# EasyEDA Pro project ProPrj_Smart_Screen_T113_PCB6.epro, schematic Schematic

## Sheets
1 CORE: Board Name: Board1_MIPI; Create Date: 2025-05-10; Page Name: CORE; Project Name: Smart_Screen_T113_1; Schematic Name: Schematic1_5; Update Date: 2025-05-10; Company: 嘉立创EDA; Page Size: A3; Version: V1.0
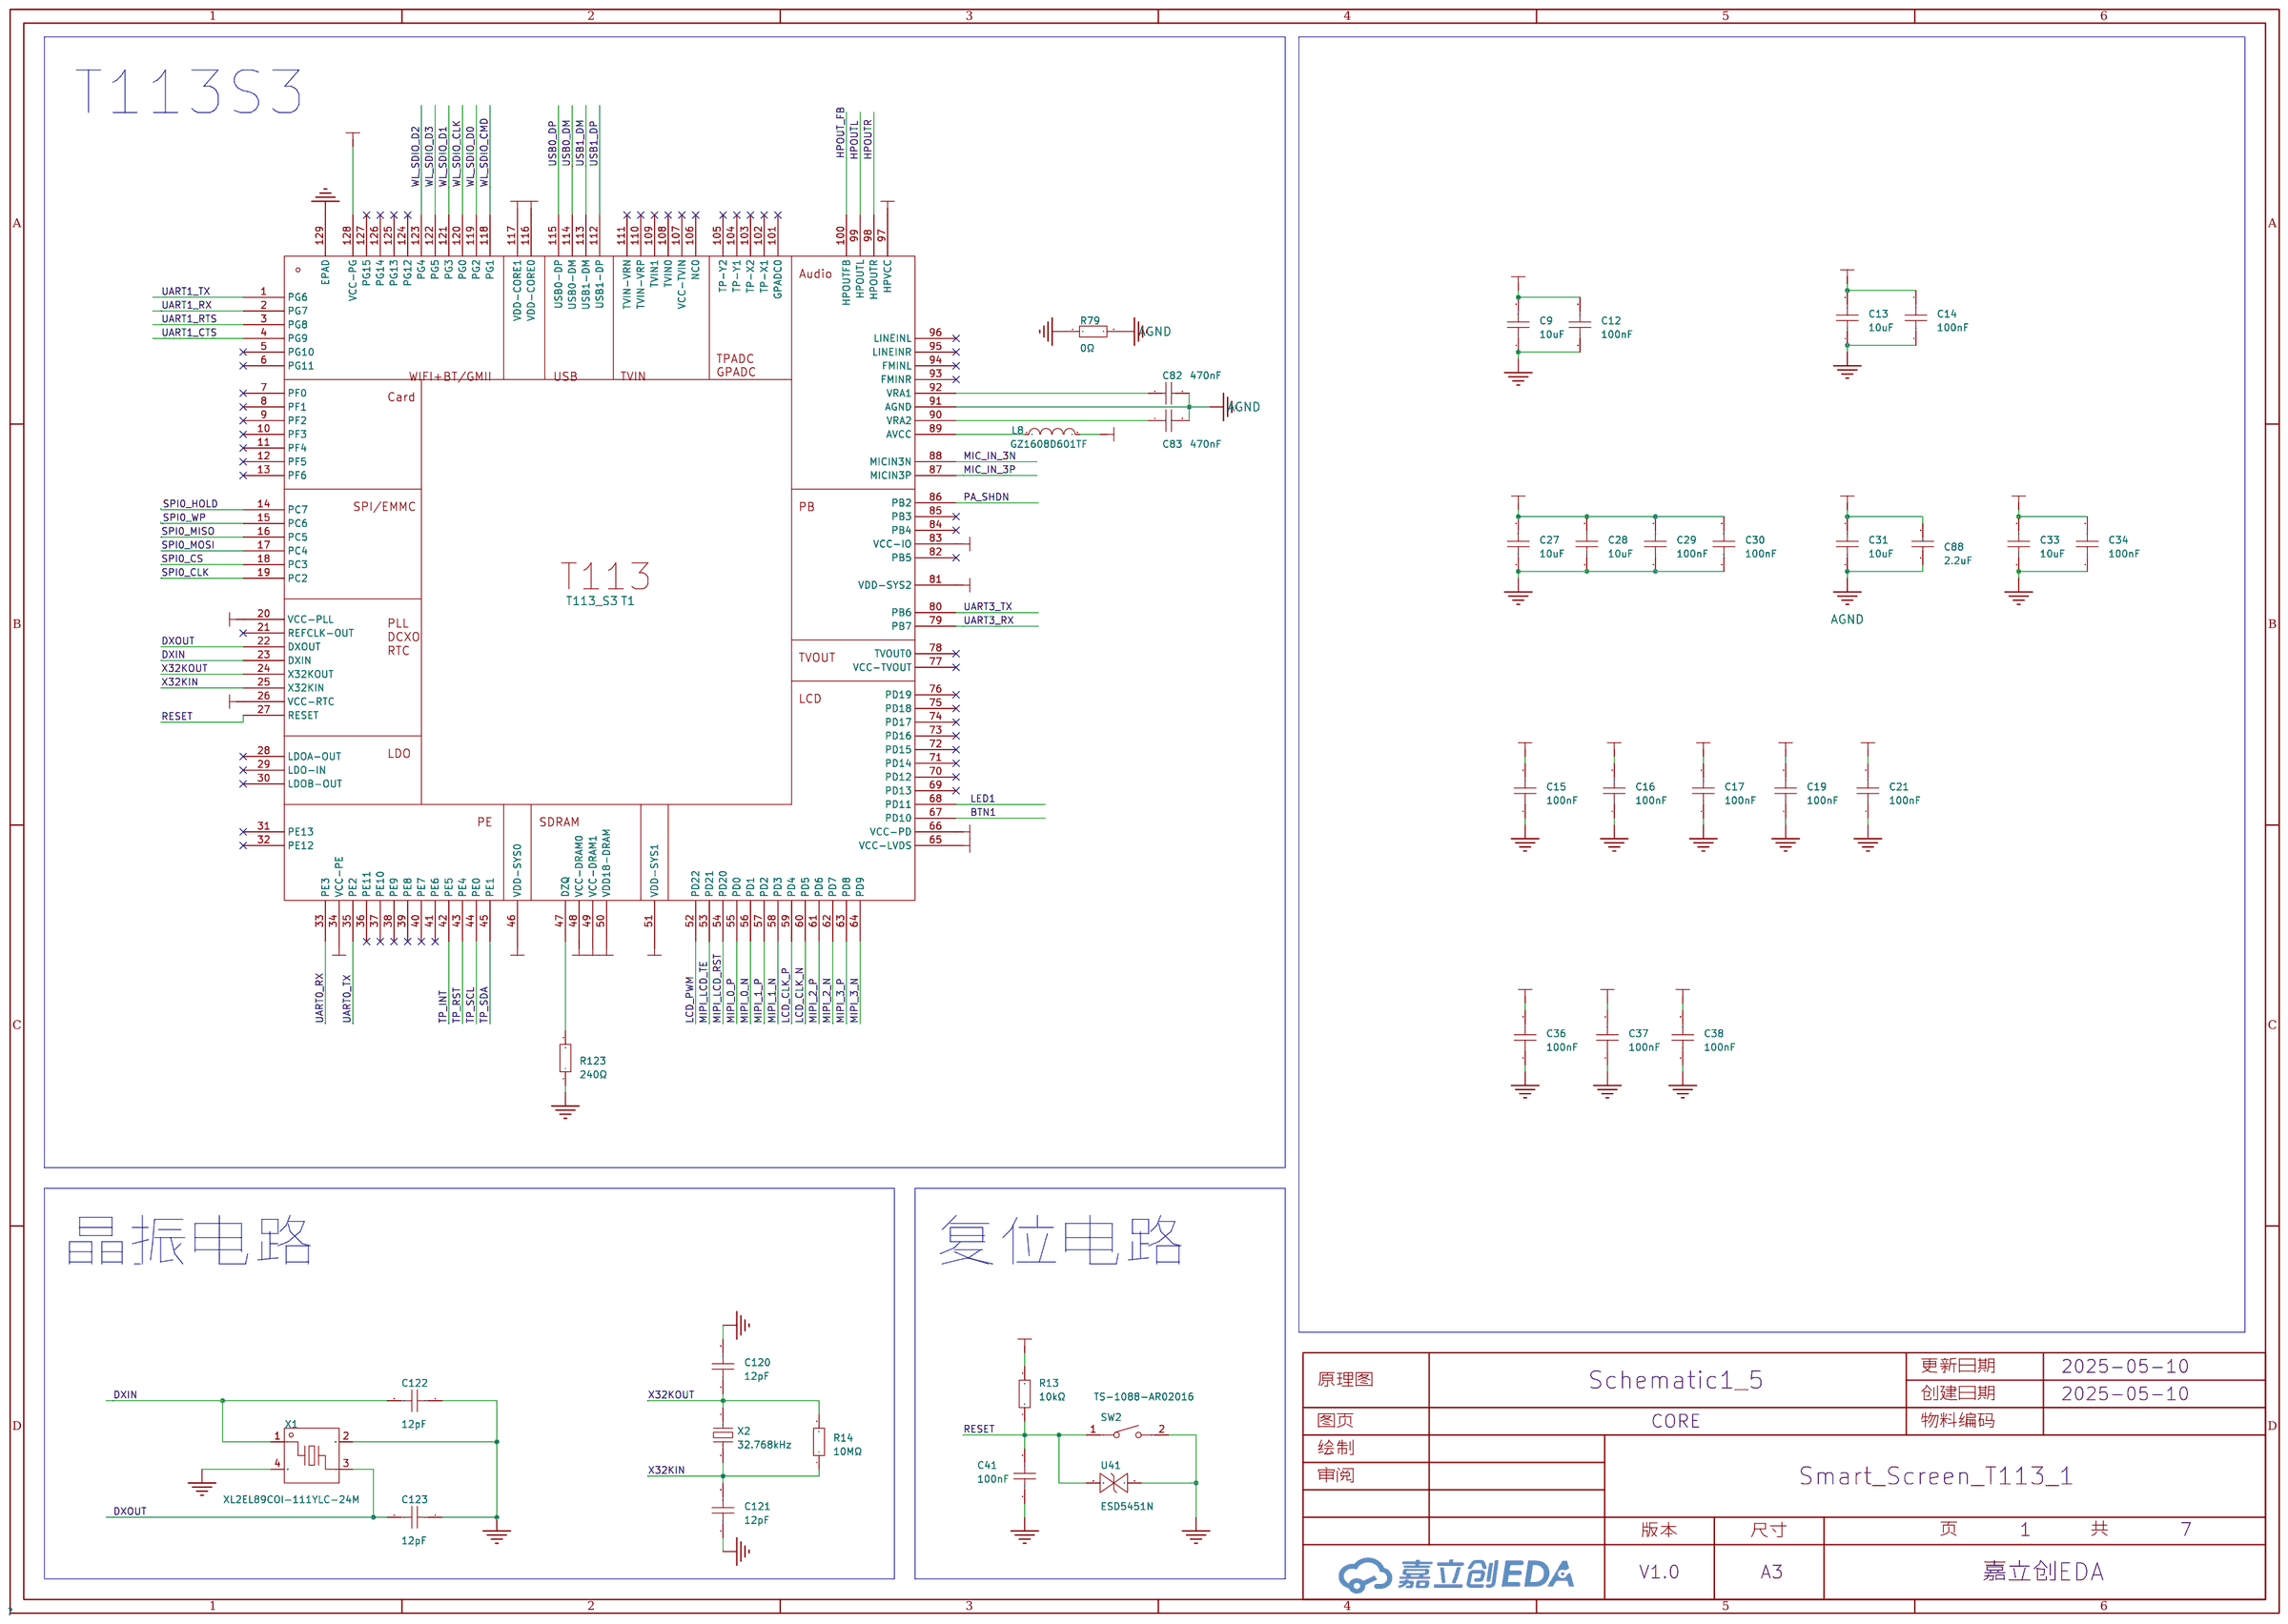
[diagram p0: CORE]
2 NET: Board Name: Board_MIPI_6_90in; Create Date: 2025-06-16; Page Name: NET; Project Name: Smart_Screen_T113_2; Schematic Name: Schematic; Update Date: 2025-06-16
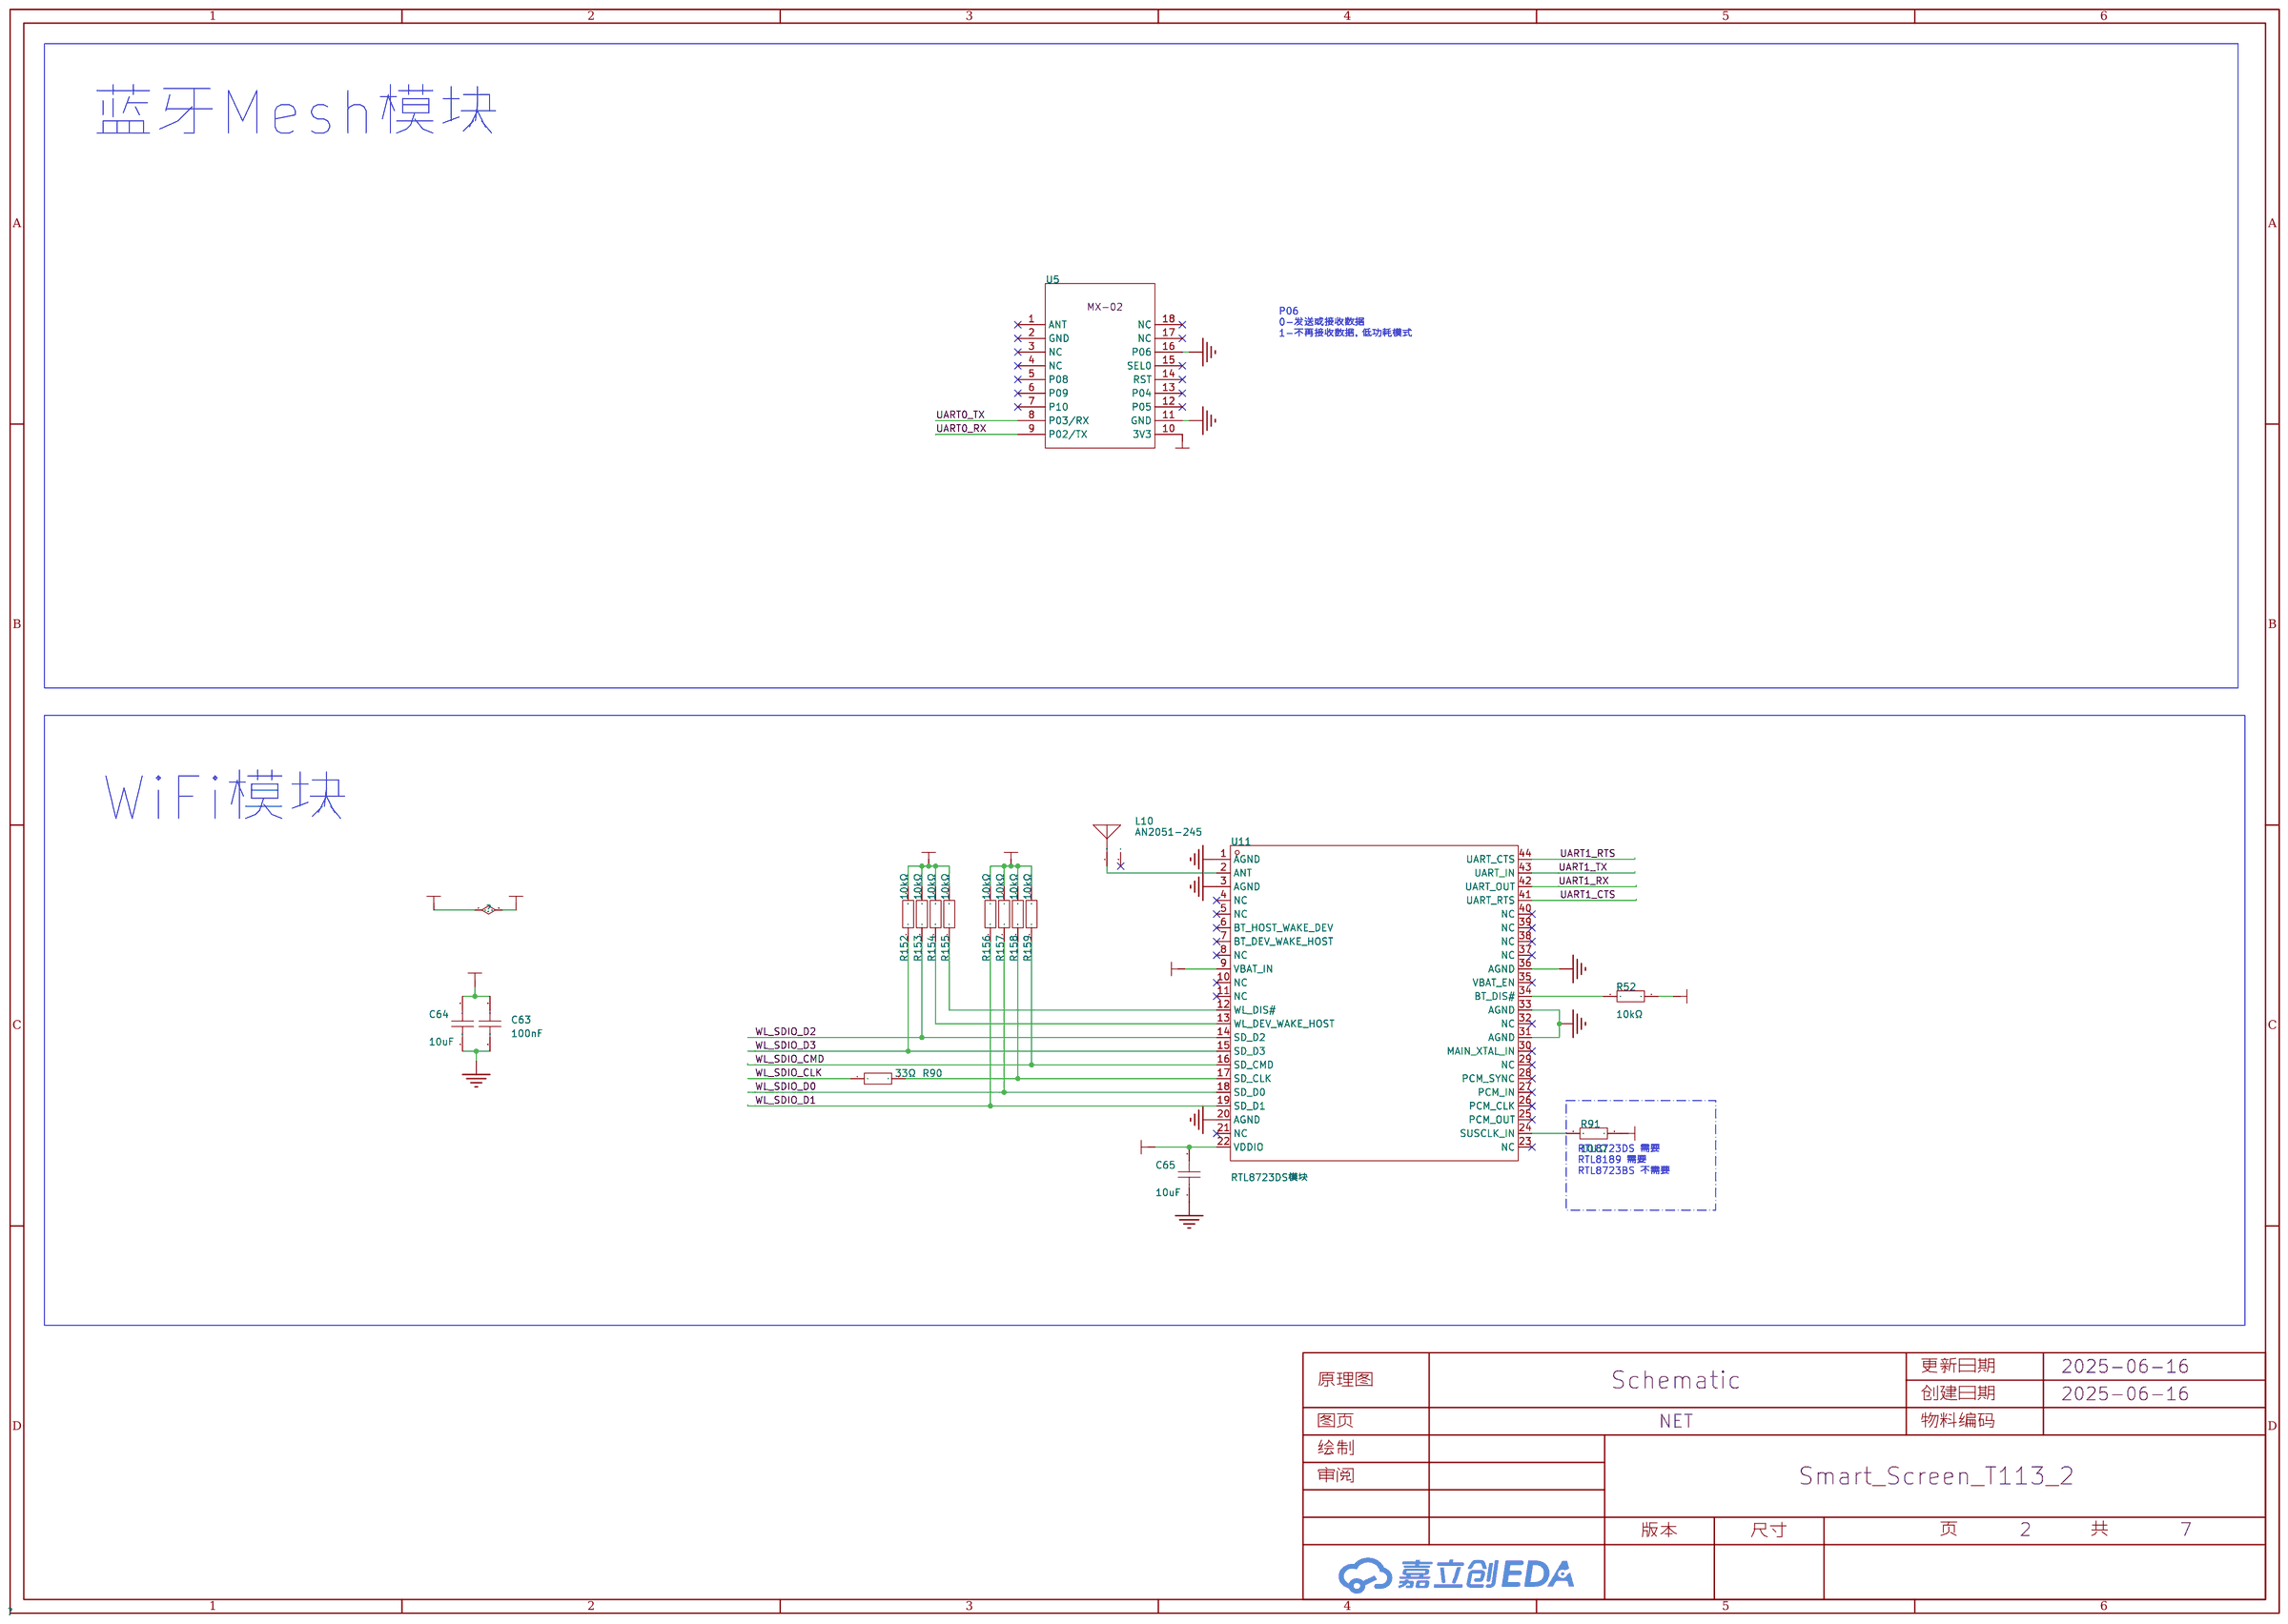
[diagram p1: NET]
3 POWER: Board Name: Board_MIPI_6_90in; Create Date: 2025-06-16; Page Name: POWER; Project Name: Smart_Screen_T113_2; Schematic Name: Schematic; Update Date: 2025-06-16
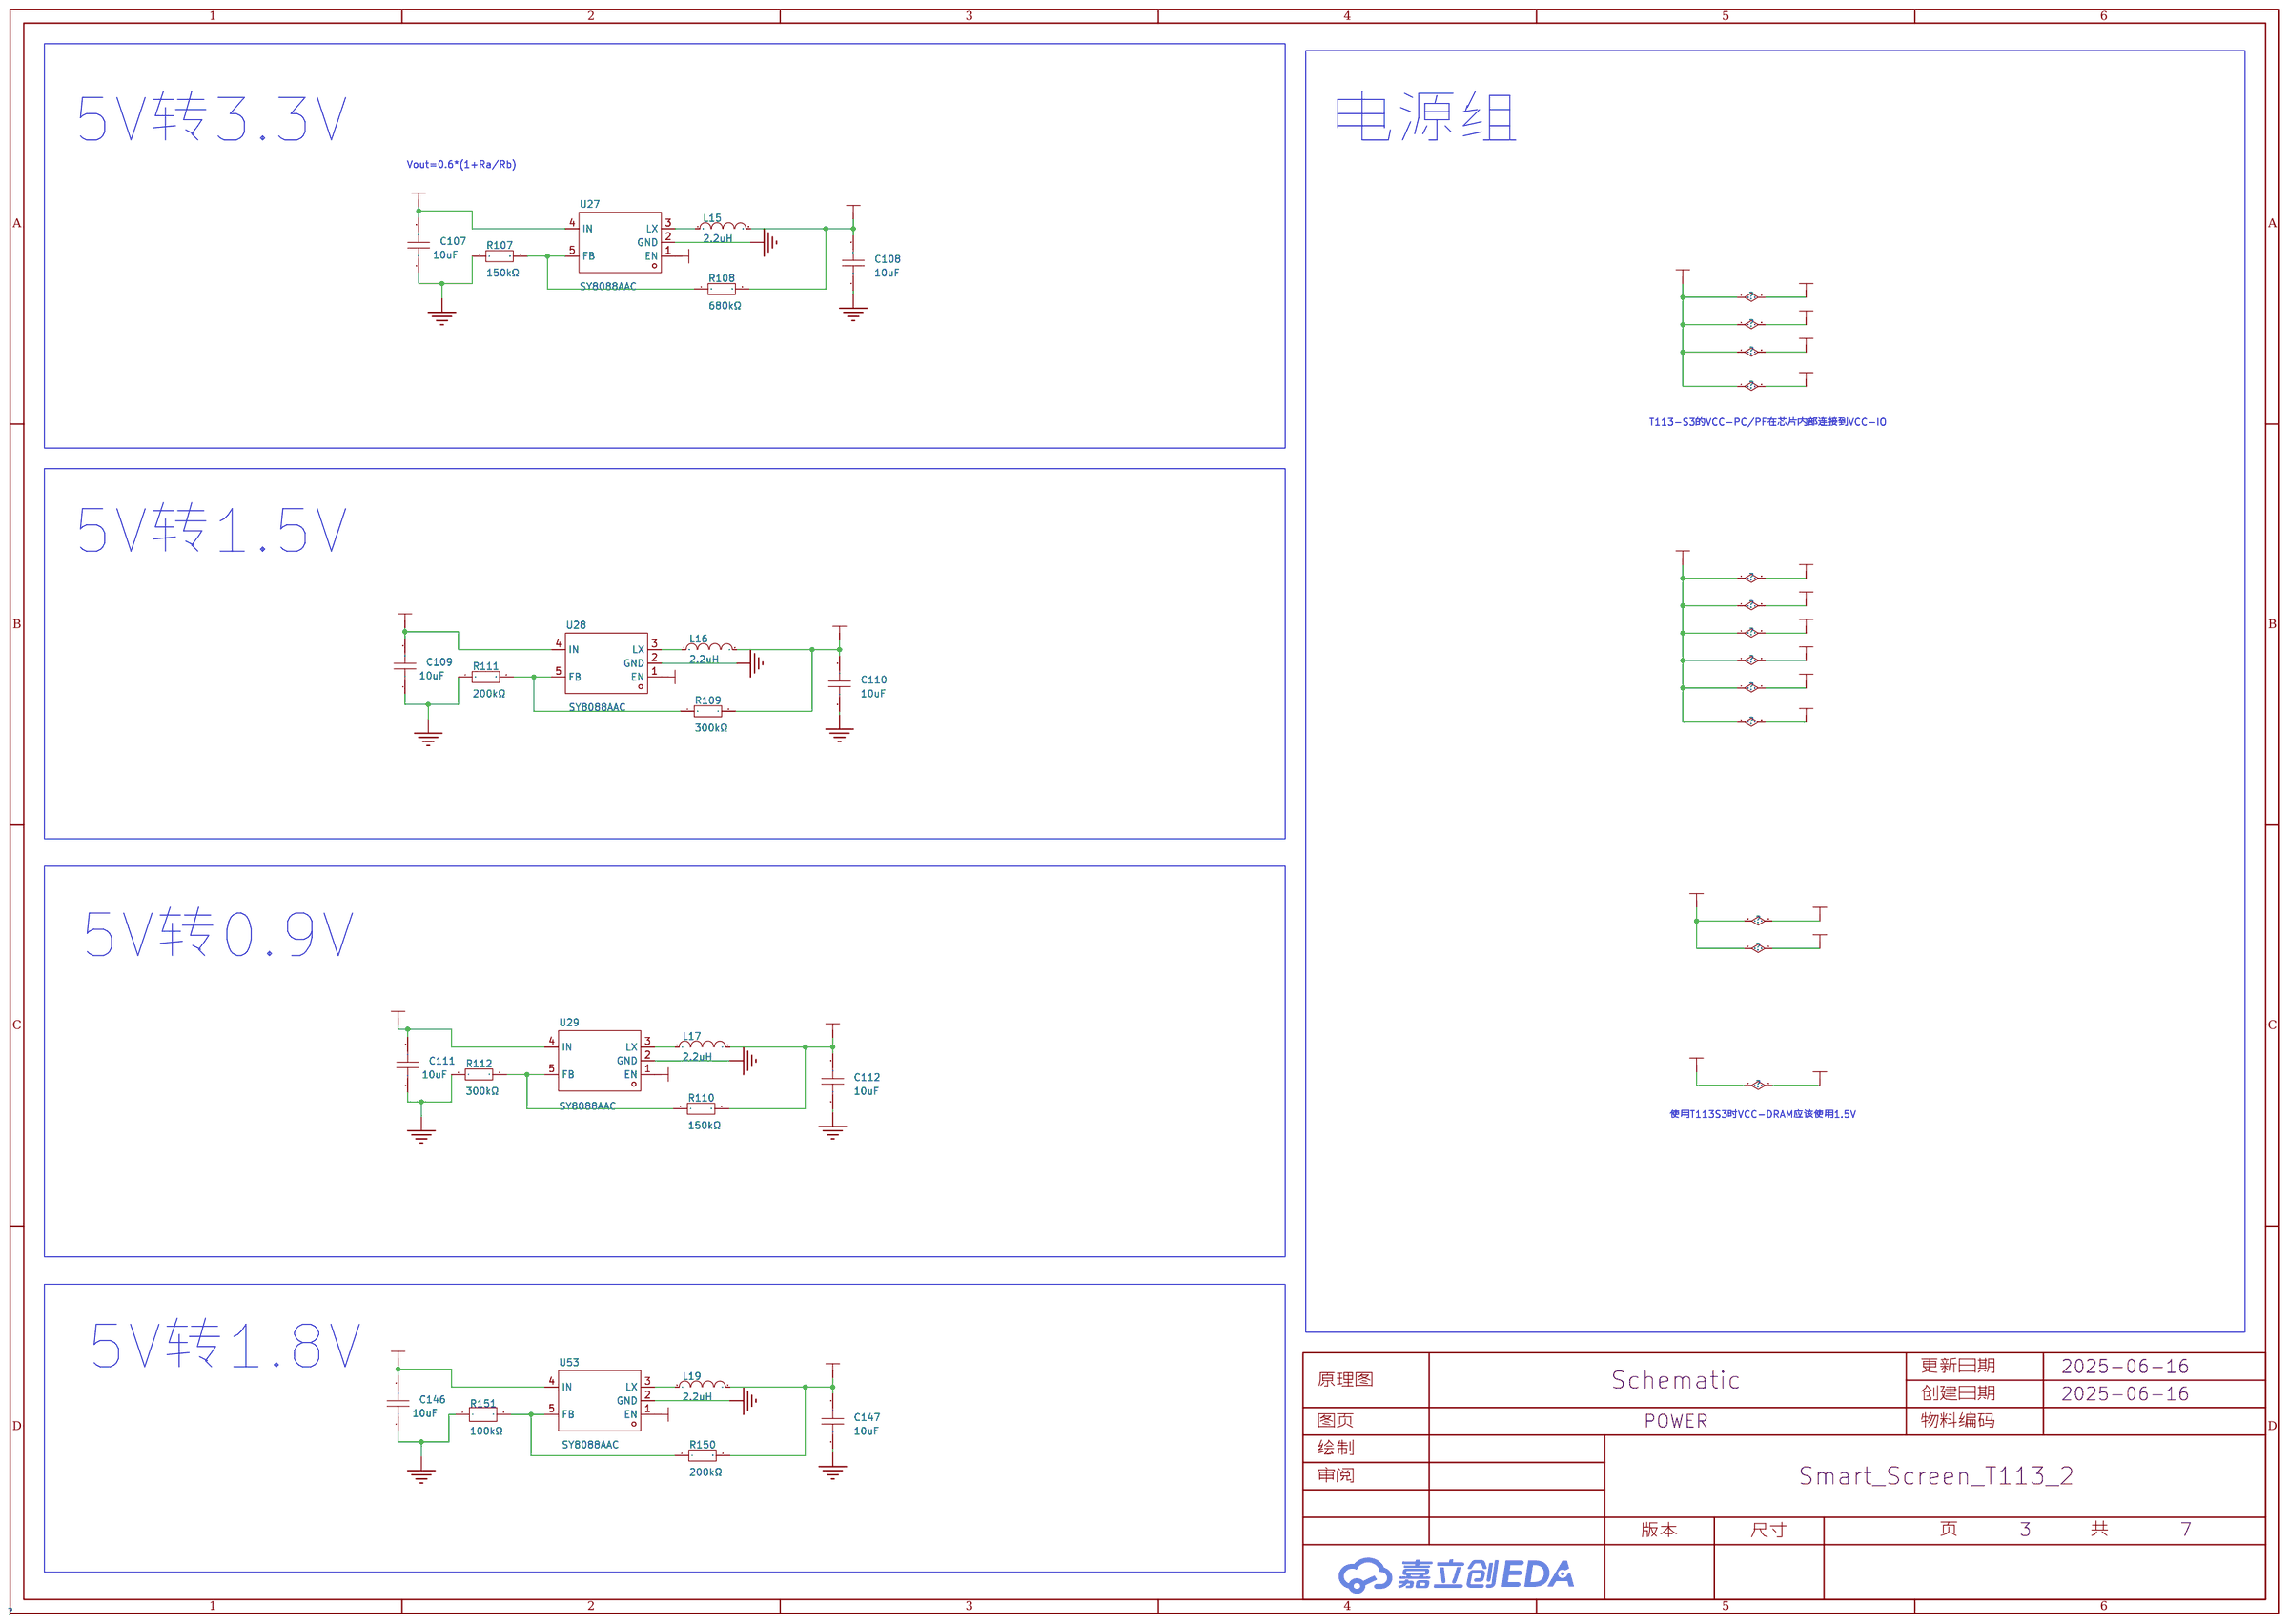
[diagram p2: POWER]
4 CONNECT: Page Name: CONNECT
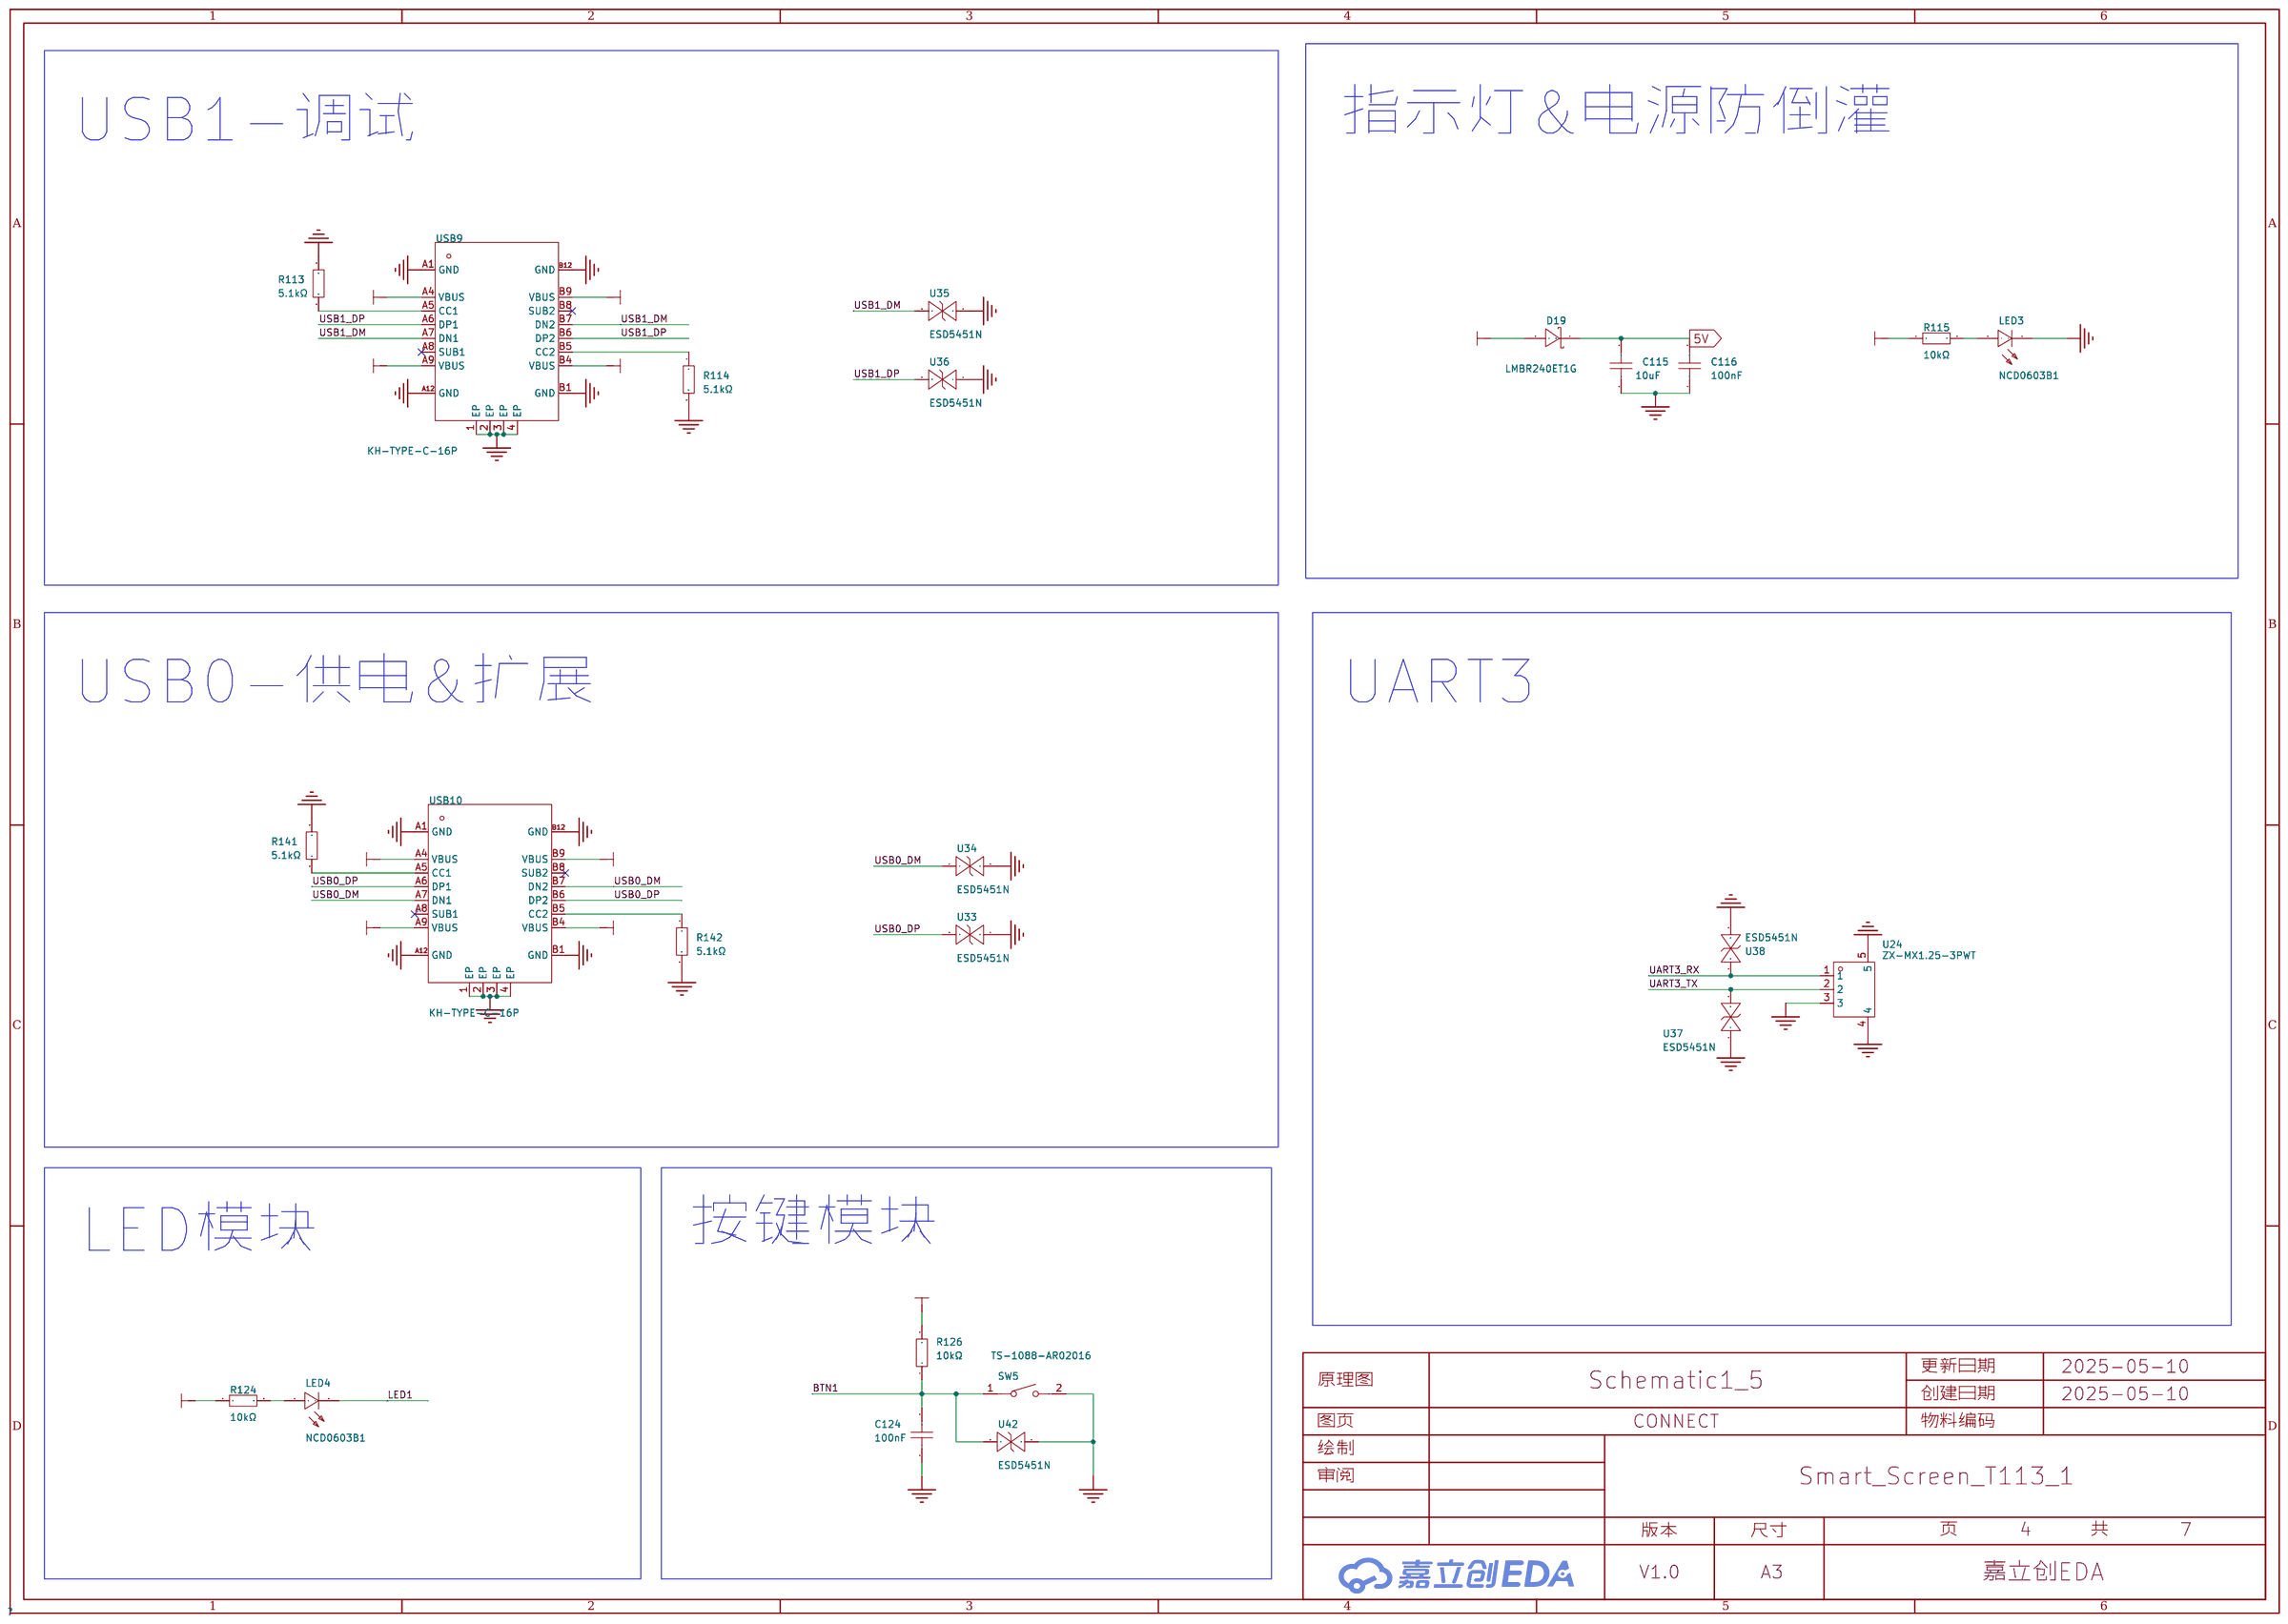
[diagram p3: CONNECT]
5 AUDIO: Page Name: AUDIO
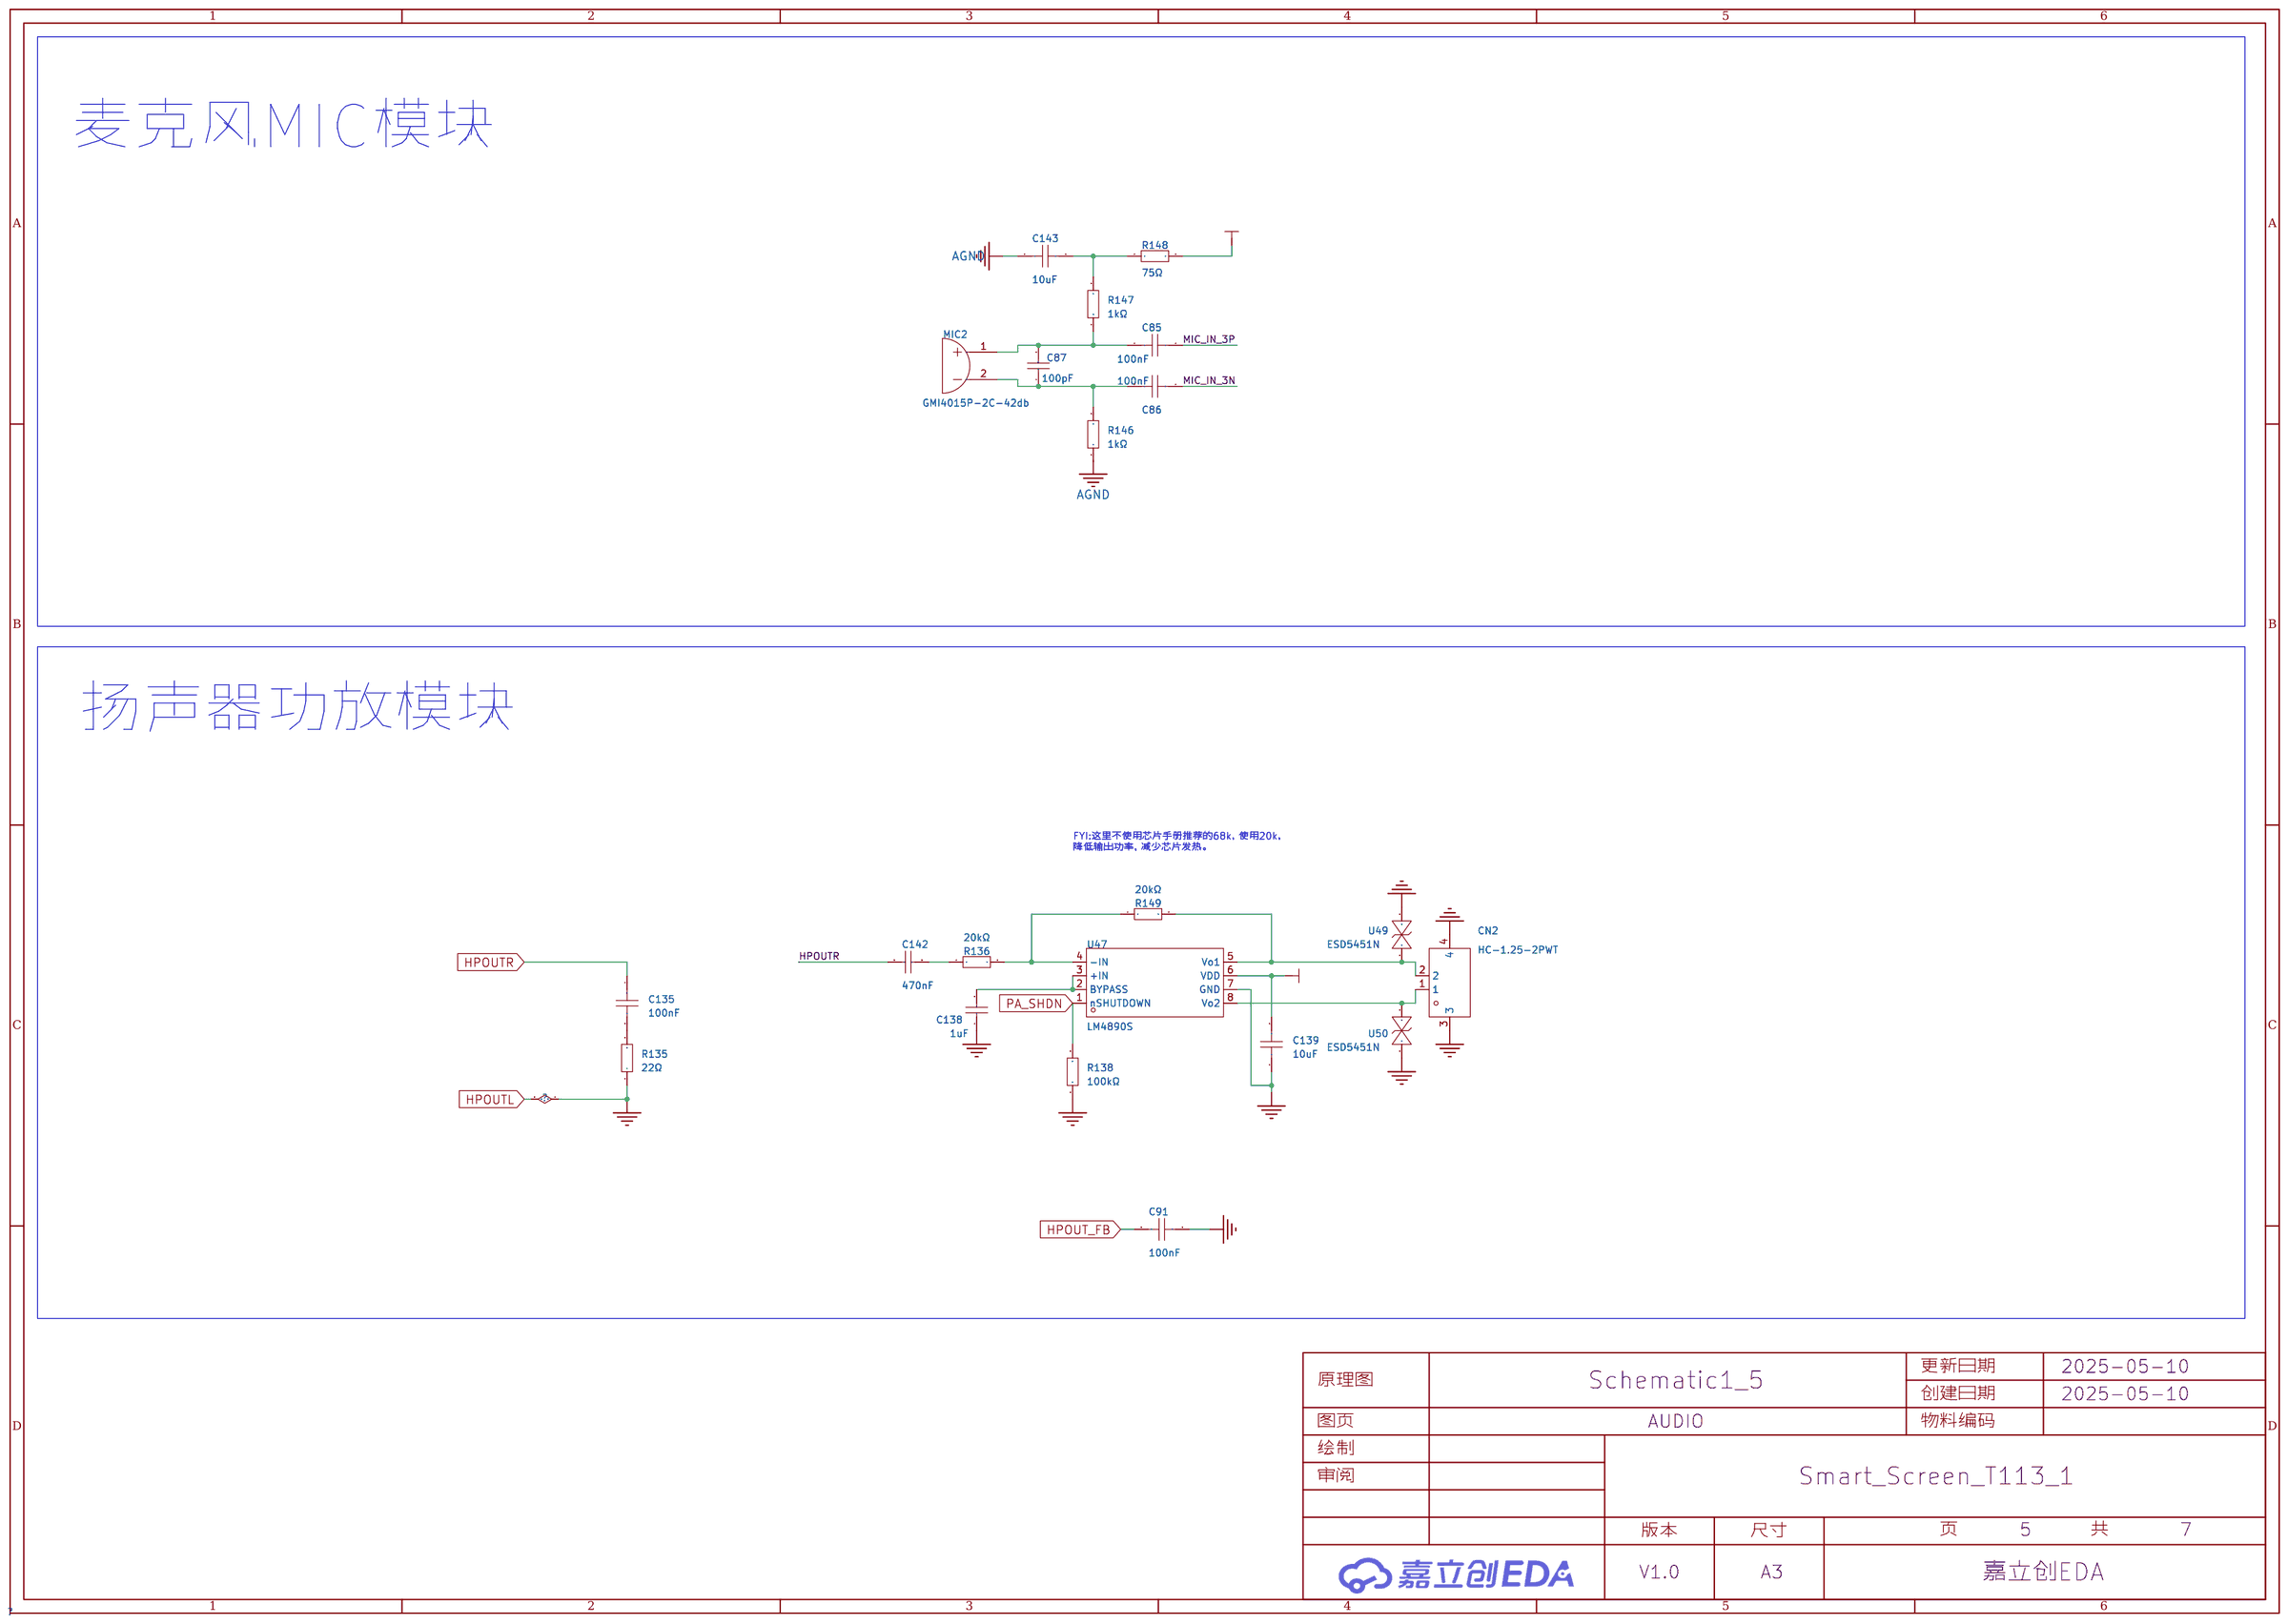
[diagram p4: AUDIO]
6 FLASH: Page Name: FLASH
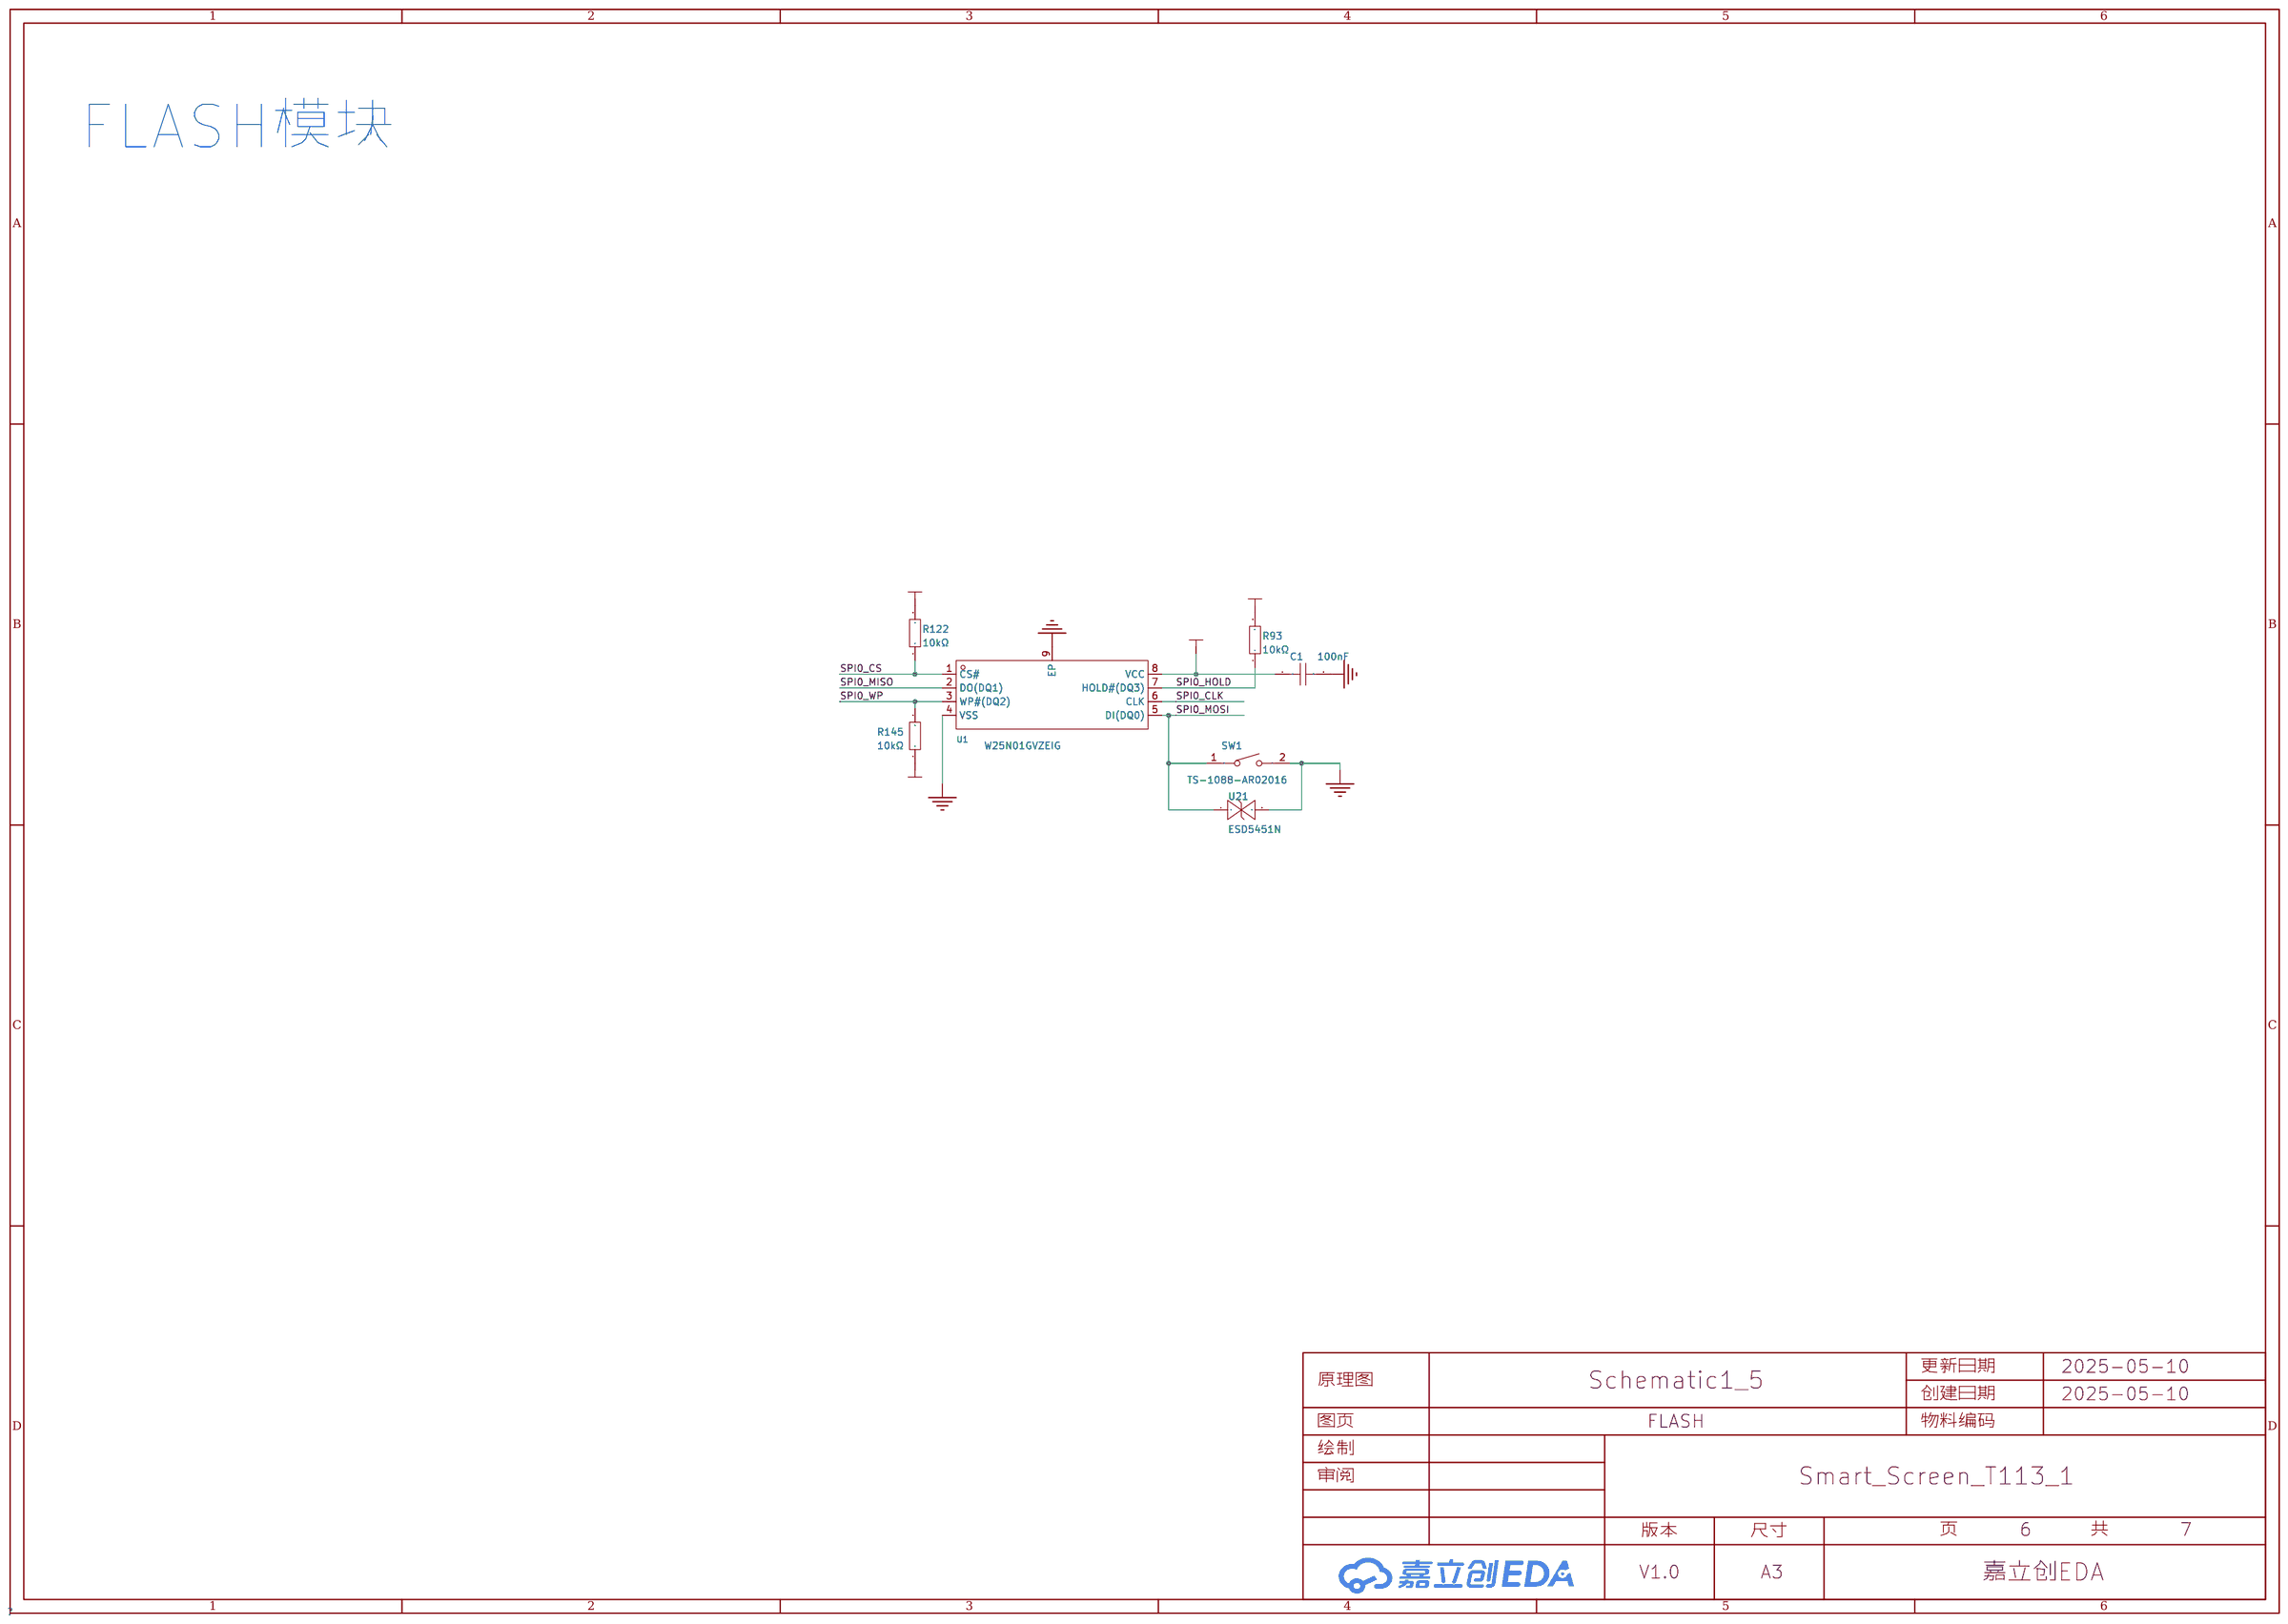
[diagram p5: FLASH]
7 DISPLAY: Board Name: Board_MIPI_6_90in; Create Date: 2025-06-16; Page Name: DISPLAY; Project Name: Smart_Screen_T113_2; Schematic Name: Schematic; Update Date: 2025-06-16
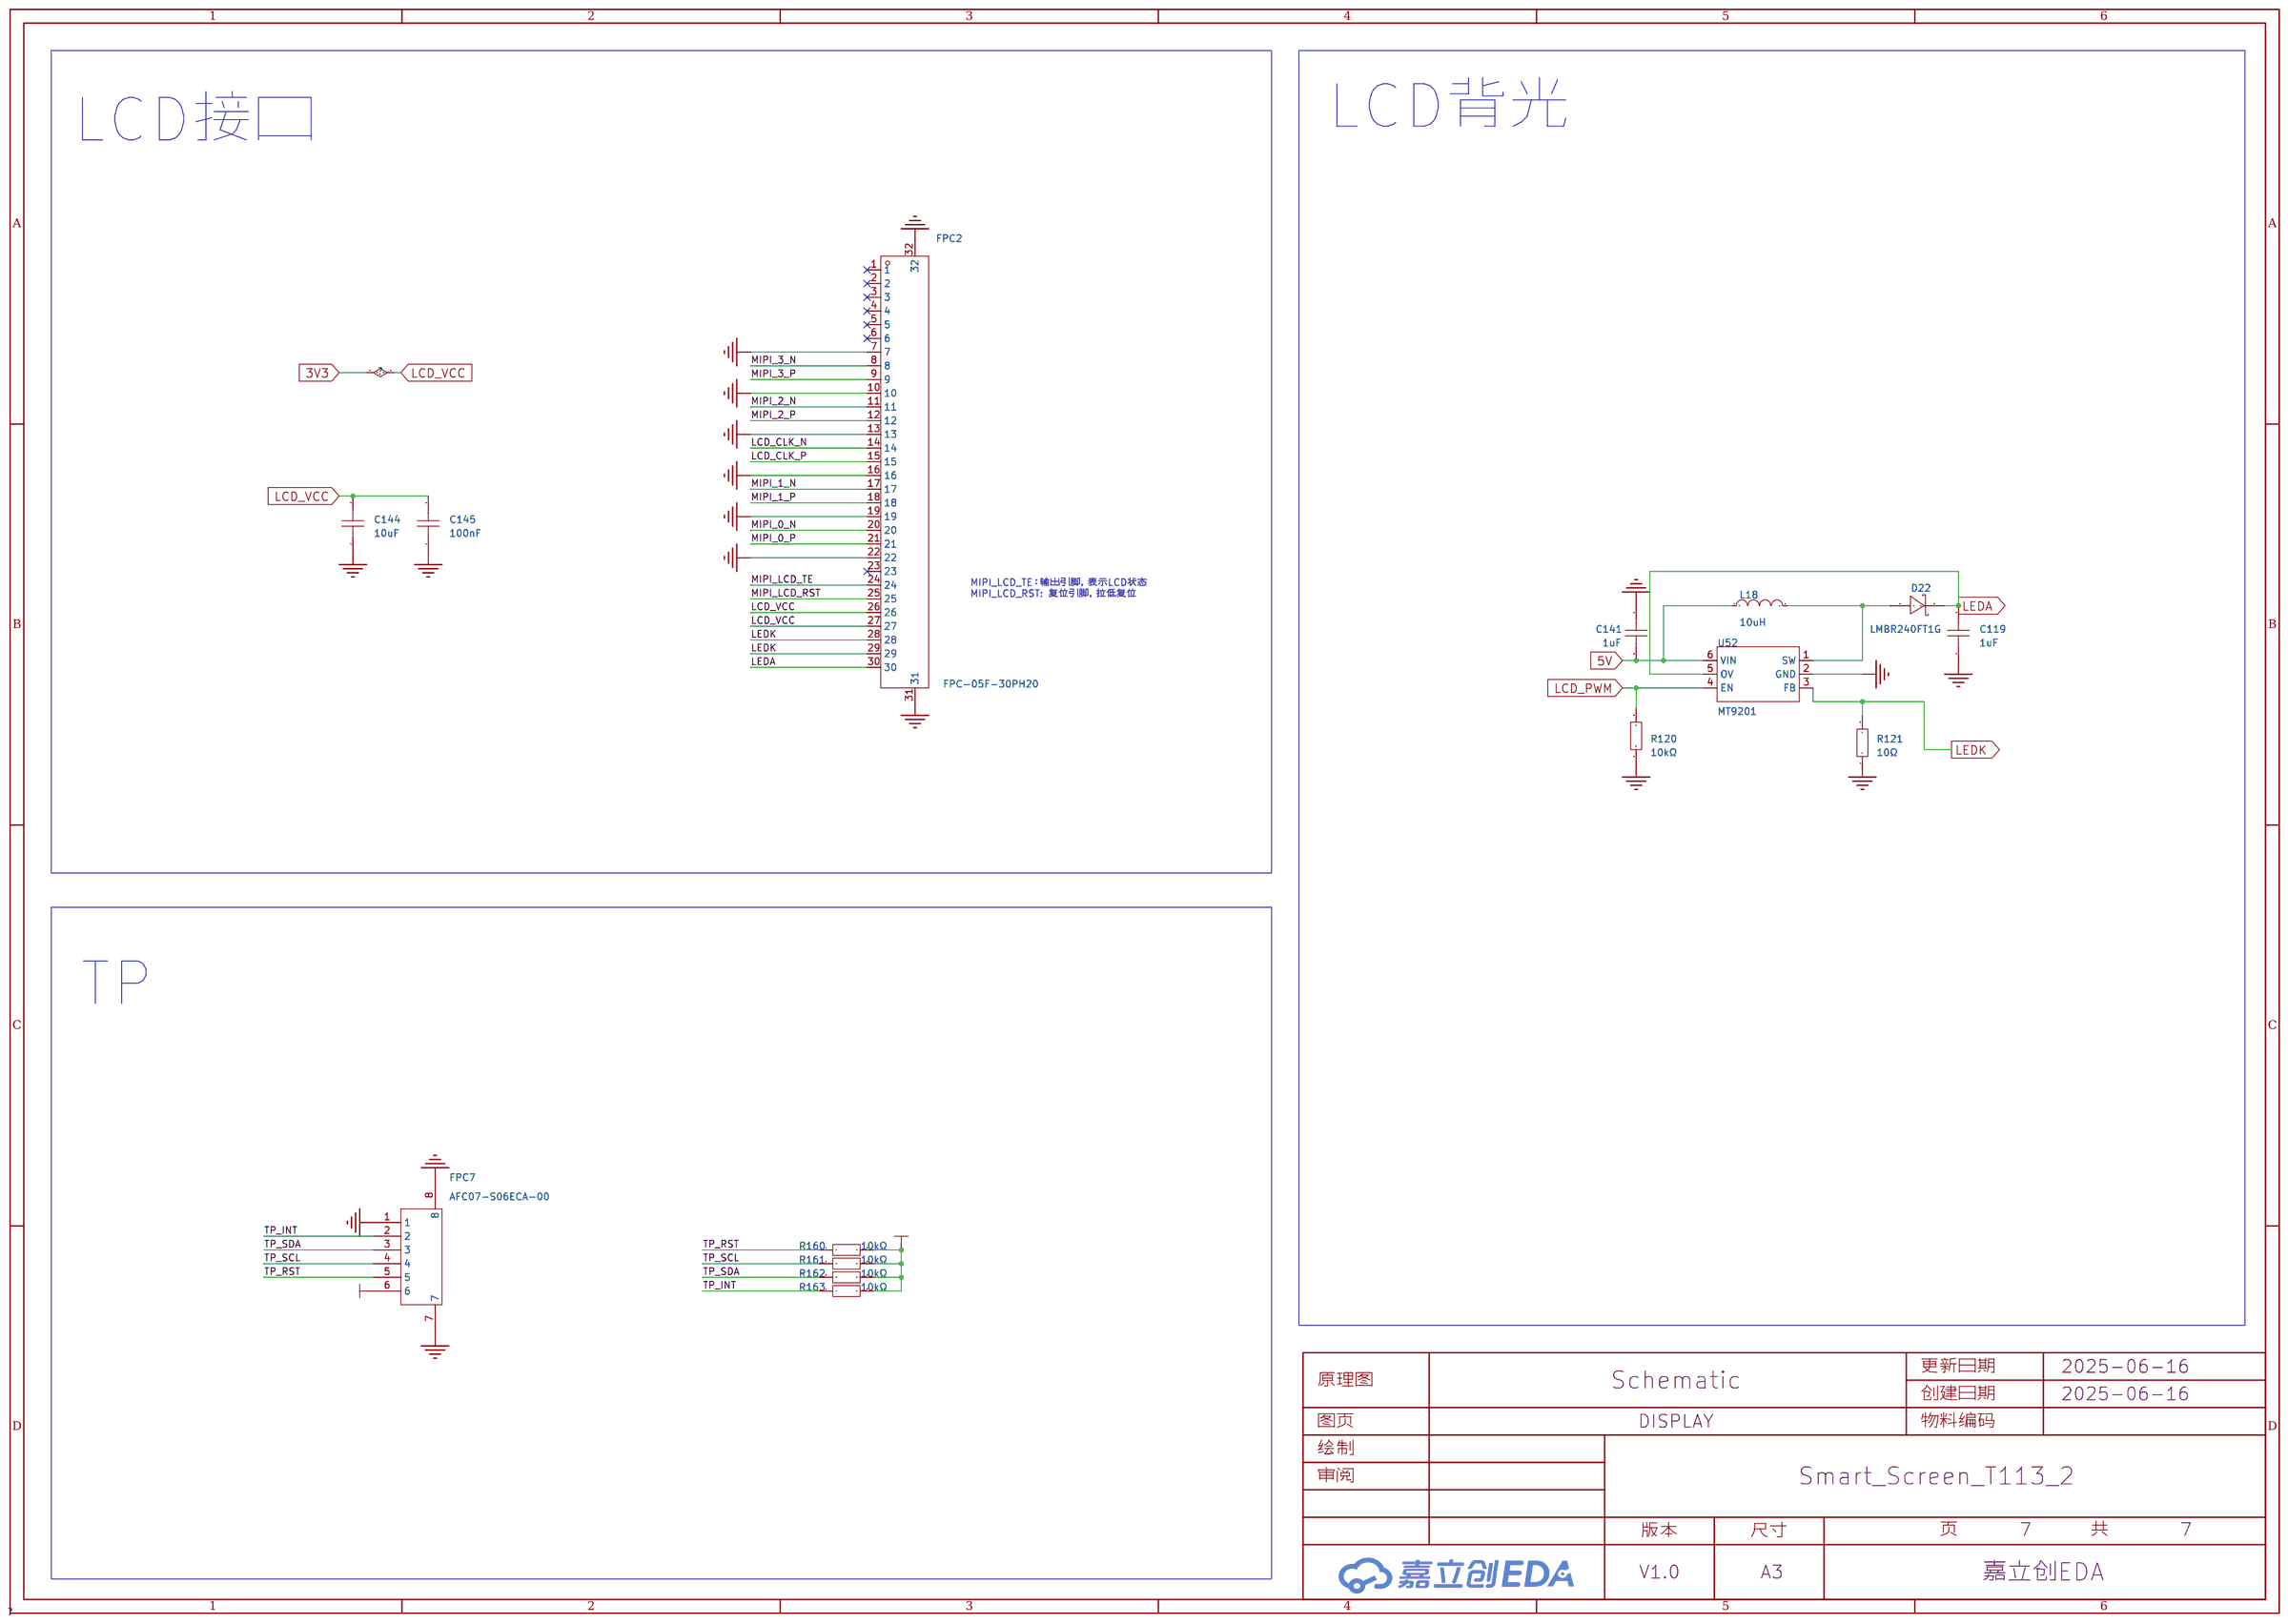
[diagram p6: DISPLAY]

## Parts
sheet AUDIO
C85  100nF  [C0603]
C86  100nF  [C0603]
C87  100pF  [C0603]
C91  100nF  [C0603]
C135  100nF  [C0603]
C138  1uF  [C0603]
C139  10uF  [C0603]
C142  470nF  [C0603]
C143  10uF  [C0603]
CN2  HC-1.25-2PWT  [CONN-SMD_2P-P1.25-HC-1.25-2PWT]
MIC2  GMI4015P-2C-42db  [MIC-TH_BD4.0-P1.40-D0.4-L-FD]
R135  22Ω  [R0603]
R136  20kΩ  [R0603]
R138  100kΩ  [R0603]
R146  1kΩ  [R0603]
R147  1kΩ  [R0603]
R148  75Ω  [R0603]
R149  20kΩ  [R0603]
U47  LM4890S  [MSOP-8_L3.0-W3.0-P0.65-LS5.0-BL]
U49  ESD5451N  [X1-DFN1006-2_L1.0-W0.6-P0.65-BI]
U50  ESD5451N  [X1-DFN1006-2_L1.0-W0.6-P0.65-BI]
sheet CONNECT
C115  10uF  [C0603]
C116  100nF  [C0603]
C124  100nF  [C0603]
D19  LMBR240ET1G  [SOD323HE_L1.8-W1.3-LS2.5-RD-1]
LED3  NCD0603B1  [LED0603-RD]
LED4  NCD0603B1  [LED0603-RD]
R113  5.1kΩ  [R0603]
R114  5.1kΩ  [R0603]
R115  10kΩ  [R0603]
R124  10kΩ  [R0603]
R126  10kΩ  [R0603]
R141  5.1kΩ  [R0603]
R142  5.1kΩ  [R0603]
SW5  TS-1088-AR02016  [SW-SMD_L3.9-W3.0-P4.45]
U24  ZX-MX1.25-3PWT  [CONN-SMD_3P-P1.25_MEGASTAR_ZX-MX1.25-3PWT]
U33  ESD5451N  [X1-DFN1006-2_L1.0-W0.6-P0.65-BI]
U34  ESD5451N  [X1-DFN1006-2_L1.0-W0.6-P0.65-BI]
U35  ESD5451N  [X1-DFN1006-2_L1.0-W0.6-P0.65-BI]
U36  ESD5451N  [X1-DFN1006-2_L1.0-W0.6-P0.65-BI]
U37  ESD5451N  [X1-DFN1006-2_L1.0-W0.6-P0.65-BI]
U38  ESD5451N  [X1-DFN1006-2_L1.0-W0.6-P0.65-BI]
U42  ESD5451N  [X1-DFN1006-2_L1.0-W0.6-P0.65-BI]
USB9  KH-TYPE-C-16P  [usb-c-smd_kh-type-c-16p]
USB10  KH-TYPE-C-16P  [usb-c-smd_kh-type-c-16p]
sheet CORE
C9  10uF  [C0603]
C12  100nF  [C0603]
C13  10uF  [C0603]
C14  100nF  [C0603]
C15  100nF  [C0603]
C16  100nF  [C0603]
C17  100nF  [C0603]
C19  100nF  [C0603]
C21  100nF  [C0603]
C27  10uF  [C0603]
C28  10uF  [C0603]
C29  100nF  [C0603]
C30  100nF  [C0603]
C31  10uF  [C0603]
C33  10uF  [C0603]
C34  100nF  [C0603]
C36  100nF  [C0603]
C37  100nF  [C0603]
C38  100nF  [C0603]
C41  100nF  [C0603]
C82  470nF  [C0603]
C83  470nF  [C0603]
C88  2.2uF  [C0603]
C120  12pF  [C0603]
C121  12pF  [C0603]
C122  12pF  [C0603]
C123  12pF  [C0603]
L8  GZ1608D601TF  [L0603]
R13  10kΩ  [R0603]
R14  10MΩ  [R0603]
R79  0Ω  [R0603]
R123  240Ω  [R0603]
SW2  TS-1088-AR02016  [SW-SMD_L3.9-W3.0-P4.45]
T1  T113_S3  [TQFP-128_L14.0-W14.0-P0.40-LS16.0-BL-EP6.4]
U41  ESD5451N  [X1-DFN1006-2_L1.0-W0.6-P0.65-BI]
X1  XL2EL89COI-111YLC-24M  [CRYSTAL-SMD_4P-L3.2-W2.5-BL]
X2  32.768kHz  [OSC-SMD_L3.2-W1.5]
sheet DISPLAY
C119  1uF  [C0603]
C141  1uF  [C0603]
C144  10uF  [C0603]
C145  100nF  [C0603]
D22  LMBR240FT1G  [SOD-123FL_L2.7-W1.8-LS3.8-RD]
FPC2  FPC-05F-30PH20  [FPC-SMD_30P-P0.50_XUNPU_FPC-05F-30PH20]
FPC7  AFC07-S06ECA-00  [FPC-SMD_P0.50-6P_LCS-SJ-H2.0]
L18  10uH  [IND-SMD_L2.0-W1.6]
R120  10kΩ  [R0603]
R121  10Ω  [R0603]
R160  10kΩ  [R0603]
R161  10kΩ  [R0603]
R162  10kΩ  [R0603]
R163  10kΩ  [R0603]
U52  MT9201  [SOT-23-6_L2.9-W1.6-P0.95-LS2.8-BR]
sheet FLASH
C1  100nF  [C0603]
R93  10kΩ  [R0603]
R122  10kΩ  [R0603]
R145  10kΩ  [R0603]
SW1  TS-1088-AR02016  [SW-SMD_L3.9-W3.0-P4.45]
U1  W25N01GVZEIG  [WSON-8_L8.0-W6.10-P1.27-BL-EP]
U21  ESD5451N  [X1-DFN1006-2_L1.0-W0.6-P0.65-BI]
sheet NET
C63  100nF  [C0603]
C64  10uF  [C0603]
C65  10uF  [C0603]
L10  AN2051-245  [ANT2051]
R52  10kΩ  [R0603]
R90  33Ω  [R0603]
R91  10kΩ  [R0603]
R152  10kΩ  [R0603]
R153  10kΩ  [R0603]
R154  10kΩ  [R0603]
R155  10kΩ  [R0603]
R156  10kΩ  [R0603]
R157  10kΩ  [R0603]
R158  10kΩ  [R0603]
R159  10kΩ  [R0603]
U5  -  [MX02]
U11  RTL8723DS模块  [WIFIM-SMD_44P-L12.0-W12.0-P0.90_RTL8723DS]
sheet POWER
C107  10uF  [C0603]
C108  10uF  [C0603]
C109  10uF  [C0603]
C110  10uF  [C0603]
C111  10uF  [C0603]
C112  10uF  [C0603]
C146  10uF  [C0603]
C147  10uF  [C0603]
L15  2.2uH  [L0805]
L16  2.2uH  [L0805]
L17  2.2uH  [L0805]
L19  2.2uH  [L0805]
R107  150kΩ  [R0603]
R108  680kΩ  [R0603]
R109  300kΩ  [R0603]
R110  150kΩ  [R0603]
R111  200kΩ  [R0603]
R112  300kΩ  [R0603]
R150  200kΩ  [R0603]
R151  100kΩ  [R0603]
U27  SY8088AAC  [SOT-23-5_L3.0-W1.7-P0.95-LS2.8-BR]
U28  SY8088AAC  [SOT-23-5_L3.0-W1.7-P0.95-LS2.8-BR]
U29  SY8088AAC  [SOT-23-5_L3.0-W1.7-P0.95-LS2.8-BR]
U53  SY8088AAC  [SOT-23-5_L3.0-W1.7-P0.95-LS2.8-BR]

## Library data of the parts
C63 C85 C86 C91 C116 = CC0603KRX7R9BB104: 容值:100nF;精度:±10%;额定电压:50V;材质(温度系数):X7R;; LCSC Part Name: 100nF ±10% 50V; Supplier Part: C14663; Manufacturer: YAGEO(国巨); Supplier Footprint: 0603; JLCPCB Part Class: 基础库; Datasheet: https://atta.szlcsc.com/upload/public/pdf/source/20180910/C282072_33301C7F631E79921B82A8DAC6BCC5B3.pdf; Supplier: LCSC; Tolerance: ±10%; Voltage Rated: 50V; Temperature Coefficient: X7R
C87 = CL10C101JB8NNNC: 容值:100pF;精度:±5%;额定电压:50V;材质(温度系数):C0G;; LCSC Part Name: 100pF ±5% 50V; Supplier Part: C14858; Manufacturer: SAMSUNG(三星); Supplier Footprint: 0603; JLCPCB Part Class: 基础库; Datasheet: https://atta.szlcsc.com/upload/public/pdf/source/20160103/1457707672333.pdf; Supplier: LCSC; Tolerance: ±5%; Voltage Rated: 50V; Temperature Coefficient: C0G
C1 C12 C14-C17 C19 C21 C29 C30 C34 C36-C38 C41 C124 C135 C145 = CC0603KRX7R9BB104: 容值:100nF;精度:±10%;额定电压:50V;材质(温度系数):X7R;; LCSC Part Name: 100nF ±10% 50V; Supplier Part: C14663; Manufacturer: YAGEO(国巨); Supplier Footprint: 0603; Datasheet: https://atta.szlcsc.com/upload/public/pdf/source/20180910/C282072_33301C7F631E79921B82A8DAC6BCC5B3.pdf; Supplier: LCSC; Tolerance: ±10%; Voltage Rated: 50V; Temperature Coefficient: X7R
C138 = CL10A105KB8NNNC: 容值:1uF;精度:±10%;额定电压:50V;材质(温度系数):X5R;; LCSC Part Name: 1uF ±10% 50V; Supplier Part: C15849; Manufacturer: SAMSUNG(三星); Supplier Footprint: 0603; JLCPCB Part Class: 基础库; Datasheet: https://atta.szlcsc.com/upload/public/pdf/source/20160103/1457707679084.pdf; Supplier: LCSC; Tolerance: ±10%; Voltage Rated: 50V; Temperature Coefficient: X5R
C64 C65 C107-C112 C115 C139 C143 C146 C147 = CL10A106MA8NRNC: 容值:10uF;精度:±20%;额定电压:25V;材质(温度系数):X5R;; LCSC Part Name: 10uF ±20% 25V; Supplier Part: C96446; Manufacturer: SAMSUNG(三星); Supplier Footprint: 0603; JLCPCB Part Class: 基础库; Datasheet: https://atta.szlcsc.com/upload/public/pdf/source/20170325/1490427913016.pdf; Supplier: LCSC; Tolerance: ±20%; Voltage Rated: 25V; Temperature Coefficient: X5R
C82 C83 C142 = CL10B474KA8NNNC: 容值:470nF;精度:±10%;额定电压:25V;材质(温度系数):X7R;; LCSC Part Name: 470nF ±10% 25V; Supplier Part: C1623; Manufacturer: SAMSUNG(三星); Supplier Footprint: 0603; Datasheet: https://atta.szlcsc.com/upload/public/pdf/source/20160218/1457707763339.pdf; Supplier: LCSC; Tolerance: ±10%; Voltage Rated: 25V; Temperature Coefficient: X7R
CN2 = HC-1.25-2PWT: 插针结构:1x2P;间距:1.25mm;安装方式:卧贴;参考系列:-;总PIN数:2P;排数:1;每排PIN数:2;行距:-;额定电流:2A;触头材质:黄铜;触头镀层:锡;工作温度范围:-25℃~+85℃;; LCSC Part Name: 1x2P 间距:1.25mm 卧贴; Supplier Part: C2845379; Manufacturer: HCTL(华灿天禄); Supplier Footprint: SMD,P=1.25mm,卧贴; JLCPCB Part Class: 扩展库; Datasheet: https://atta.szlcsc.com/upload/public/pdf/source/20230707/D26CCCA63A4ED0B68E63A615510D7FF9.pdf; Supplier: LCSC; Pins Structure: 1x2P; Pitch: 1.25mm; Mounting Style: 卧贴; Number of Pins: 2P; Number of Rows: 1; Number of PINs Per Row: 2; Current Rating (Max): 2A; Contact Material: 黄铜; Contact Plating: 锡; Operating Temperature Range: -25℃~+85℃
MIC2 = GMI4015P-2C-42db: LCSC Part Name: 全指向双电容φ4.0*1.5mm 1.5V-10V 灵敏度-42dB 低阻抗; Supplier Part: C233292; Manufacturer: INGHAi(赢海); Supplier Footprint: 插件,D=4mm; JLCPCB Part Class: 扩展库; Datasheet: https://atta.szlcsc.com/upload/public/pdf/source/20180613/C233304_D8FE5A0D9DC594913DFA1A209BBF4764.pdf; Supplier: LCSC
R135 = 0603WAF220JT5E: 电阻类型:厚膜电阻;阻值:22Ω;精度:±1%;功率:100mW;温度系数:±100ppm/℃;; LCSC Part Name: 厚膜电阻 22Ω ±1% 100mW; Supplier Part: C23345; Manufacturer: UNI-ROYAL(厚声); Supplier Footprint: 0603; JLCPCB Part Class: 基础库; Datasheet: https://atta.szlcsc.com/upload/public/pdf/source/20200306/C422600_1E6D84923E4A46A82E41ADD87F860B5C.pdf; Supplier: LCSC; Type: 厚膜电阻; Tolerance: ±1%; Power(Watts): 100mW; Temperature Coefficient: ±100ppm/℃; Overload Voltage (Max): 75V; Operating Temperature Range: -55℃~+155℃
R136 R149 = 0603WAF2002T5E: 电阻类型:厚膜电阻;阻值:20kΩ;精度:±1%;功率:100mW;; LCSC Part Name: 20kΩ ±1% 100mW; Supplier Part: C4184; Manufacturer: UNI-ROYAL(厚声); Supplier Footprint: 0603; JLCPCB Part Class: 基础库; Datasheet: https://atta.szlcsc.com/upload/public/pdf/source/20200306/C422600_1E6D84923E4A46A82E41ADD87F860B5C.pdf; Supplier: LCSC; Type: 厚膜电阻; Tolerance: ±1%; Power(Watts): 100mW; Temperature Coefficient: ±100ppm/℃; Overload Voltage (Max): 75V; Operating Temperature Range: -55℃~+155℃
R138 = 0603WAF1003T5E: 电阻类型:厚膜电阻;阻值:100kΩ;精度:±1%;功率:100mW;最大工作电压:75V;温度系数:±100ppm/℃;; LCSC Part Name: 100kΩ ±1% 100mW 厚膜电阻; Supplier Part: C25803; Manufacturer: UNI-ROYAL(厚声); Supplier Footprint: 0603; JLCPCB Part Class: 基础库; Datasheet: https://atta.szlcsc.com/upload/public/pdf/source/20200306/C422600_1E6D84923E4A46A82E41ADD87F860B5C.pdf; Supplier: LCSC; Type: 厚膜电阻; Tolerance: ±1%; Power(Watts): 100mW; Overload Voltage (Max): 75V; Temperature Coefficient: ±100ppm/℃; Operating Temperature Range: -55℃~+155℃
R146 R147 = 0603WAF1001T5E: 电阻类型:厚膜电阻;阻值:1kΩ;精度:±1%;功率:100mW;最大工作电压:75V;温度系数:±100ppm/℃;; LCSC Part Name: 1kΩ ±1% 100mW 厚膜电阻; Supplier Part: C21190; Manufacturer: UNI-ROYAL(厚声); Supplier Footprint: 0603; JLCPCB Part Class: 基础库; Datasheet: https://atta.szlcsc.com/upload/public/pdf/source/20200306/C422600_1E6D84923E4A46A82E41ADD87F860B5C.pdf; Supplier: LCSC; Type: 厚膜电阻; Tolerance: ±1%; Power(Watts): 100mW; Overload Voltage (Max): 75V; Temperature Coefficient: ±100ppm/℃; Operating Temperature Range: -55℃~+155℃
R148 = 0603WAF750JT5E: 电阻类型:厚膜电阻;阻值:75Ω;精度:±1%;功率:100mW;最大工作电压:75V;温度系数:±200ppm/℃;; LCSC Part Name: 75Ω ±1% 100mW 厚膜电阻; Supplier Part: C4275; Manufacturer: UNI-ROYAL(厚声); Supplier Footprint: 0603; JLCPCB Part Class: 基础库; Datasheet: https://atta.szlcsc.com/upload/public/pdf/source/20200306/C422600_1E6D84923E4A46A82E41ADD87F860B5C.pdf; Supplier: LCSC; Type: 厚膜电阻; Tolerance: ±1%; Power(Watts): 100mW; Overload Voltage (Max): 75V; Temperature Coefficient: ±200ppm/℃; Operating Temperature Range: -55℃~+155℃
U47 = LM4890S_C329452: 功放类型:-;扬声器通道数:单声道;输出功率:-;静态电流(Iq):-;; Supplier Part: C329452; Manufacturer: IDCHIP(英锐芯); Supplier Footprint: MSOP-8; JLCPCB Part Class: 扩展库; Datasheet: https://atta.szlcsc.com/upload/public/pdf/source/20190121/C329452_9DA1BC198EDF4C12DB2B5C9529AAE98C.pdf; Supplier: LCSC; Speaker Channels: 单声道; Supply Voltage: 2.2V~5.5V
U21 U33-U38 U41 U42 U49 U50 = ESD5451N_C2936977: LCSC Part Name: ESD二极管; Supplier Part: C2936977; Manufacturer: TECH PUBLIC(台舟); Supplier Footprint: DFN1006-2; JLCPCB Part Class: 扩展库; Datasheet: https://atta.szlcsc.com/upload/public/pdf/source/20211227/D040CF3F0222548C5BD9F7E690946783.pdf; Supplier: LCSC
D19 = LMBR240ET1G: 正向压降(Vf):500mV;直流反向耐压(Vr):40V;平均整流电流(Io):2A;; LCSC Part Name: 电压:40V 电流:2A; Supplier Part: C383229; Manufacturer: LRC(乐山无线电); Supplier Footprint: SOD-323HE; JLCPCB Part Class: 扩展库; Datasheet: https://atta.szlcsc.com/upload/public/pdf/source/20190402/C383229_61A11B95914AF5137E755BFECCEAD6A5.pdf; Supplier: LCSC; Forward Voltage (Vf@If): 500mV; Reverse Voltage (Vr): 40V; Average Rectified Current (Io): 2A; Reverse Leakage Current (Ir): 100uA
LED3 LED4 = NCD0603B1: 发光颜色:蓝灯;; LCSC Part Name: 蓝灯; Supplier Part: C84266; Manufacturer: 国星光电; Supplier Footprint: 0603; JLCPCB Part Class: 扩展库; Datasheet: https://atta.szlcsc.com/upload/public/pdf/source/20200820/C84266_6A3CDBEFA72C6CAD68EDA53474ADAE6C.pdf; Supplier: LCSC; Emitted Color: 蓝灯
R113 R114 R141 R142 = 0603WAF5101T5E: 电阻类型:厚膜电阻;阻值:5.1kΩ;精度:±1%;功率:100mW;; LCSC Part Name: 5.1kΩ ±1% 100mW; Supplier Part: C23186; Manufacturer: UNI-ROYAL(厚声); Supplier Footprint: 0603; JLCPCB Part Class: 基础库; Datasheet: https://atta.szlcsc.com/upload/public/pdf/source/20200306/C422600_1E6D84923E4A46A82E41ADD87F860B5C.pdf; Supplier: LCSC; Type: 厚膜电阻; Tolerance: ±1%; Power(Watts): 100mW; Temperature Coefficient: ±100ppm/℃; Overload Voltage (Max): 75V; Operating Temperature Range: -55℃~+155℃
R52 R115 R124 = 0603WAF1002T5E: 电阻类型:厚膜电阻;阻值:10kΩ;精度:±1%;功率:100mW;; LCSC Part Name: 厚膜电阻 10kΩ ±1% 100mW; Supplier Part: C25804; Manufacturer: UNI-ROYAL(厚声); Supplier Footprint: 0603; JLCPCB Part Class: 基础库; Datasheet: https://atta.szlcsc.com/upload/public/pdf/source/20200306/C422600_1E6D84923E4A46A82E41ADD87F860B5C.pdf; Supplier: LCSC; Type: 厚膜电阻; Tolerance: ±1%; Power(Watts): 100mW; Temperature Coefficient: ±100ppm/℃; Overload Voltage (Max): 75V; Operating Temperature Range: -55℃~+155℃
R13 R91 R93 R120 R122 R126 R145 = 0603WAF1002T5E: 电阻类型:厚膜电阻;阻值:10kΩ;精度:±1%;功率:100mW;最大工作电压:75V;温度系数:±100ppm/℃;; LCSC Part Name: 10kΩ ±1% 100mW 厚膜电阻; Supplier Part: C25804; Manufacturer: UNI-ROYAL(厚声); Supplier Footprint: 0603; JLCPCB Part Class: Basic Part; Datasheet: https://atta.szlcsc.com/upload/public/pdf/source/20200306/C422600_1E6D84923E4A46A82E41ADD87F860B5C.pdf; Supplier: LCSC; Type: 厚膜电阻; Tolerance: ±1%; Power(Watts): 100mW; Overload Voltage (Max): 75V; Temperature Coefficient: ±100ppm/℃; Operating Temperature Range: -55℃~+155℃
SW1 SW2 SW5 = TS-1088-AR02016: 电路结构:单刀单掷;按钮形状:圆形按钮;作用力:160gf;安装方式:立贴;开关长度:4mm;开关宽度:3mm;开关高度:2mm;带支架:不带;触点电流:50mA;额定电压(DC):12V;绝缘电阻:100MΩ;机械寿命:10万次;; LCSC Part Name: 4*3*2mm 立贴 轻触开关; Supplier Part: C720477; Manufacturer: XUNPU(讯普); Supplier Footprint: SMD; Datasheet: https://atta.szlcsc.com/upload/public/pdf/source/20200810/C720475_60D09DD6C54279ADDB2DC25100F1CC11.pdf; Supplier: LCSC; Circuit: 单刀单掷; Actuator Style: 圆形按钮; Operating Force: 160gf; Mounting Style: 立贴; Switch Length: 4mm; Switch Width: 3mm; Switch Height: 2mm; Strike Gundam: 不带; Contact Current: 50mA; Voltage Rating (DC): 12V; Insulation Resistance: 100MΩ; Actuator/Cap Color: 黑色; Pin Style: SMD接片; Mechanical Life: 10万次; Operating Temperature: -30℃~+80℃
U24 = ZX-MX1.25-3PWT: 插针结构:1x3P;间距:1.25mm;安装方式:卧贴;参考系列:-;总PIN数:3P;排数:1;每排PIN数:3;行距:-;额定电流:1A;触头材质:黄铜;触头镀层:锡;工作温度范围:-25℃~+85℃;; LCSC Part Name: 1x3P 间距:1.25mm 卧贴; Supplier Part: C7430469; Manufacturer: Megastar(兆星); Supplier Footprint: SMD,P=1.25mm,卧贴; Datasheet: https://atta.szlcsc.com/upload/public/pdf/source/20230619/F53A6BBA29708C54D1E94831F29660FB.pdf; Supplier: LCSC; Pins Structure: 1x3P; Pitch: 1.25mm; Mounting Style: 卧贴; Number of Pins: 3P; Number of Rows: 1; Number of PINs Per Row: 3; Current Rating (Max): 1A; Contact Material: 黄铜; Contact Plating: 锡; Operating Temperature Range: -25℃~+85℃
USB9 USB10 = KH-TYPE-C-16P: 连接器类型:Type-C;标准:-;公母:母;端口数量:1;触点数量:16P;安装方式:卧贴;额定电流 - 电源:3A;工作温度范围:-40℃~+85℃;; LCSC Part Name: Type-C 母 卧贴; Supplier Part: C709357; Manufacturer: kinghelm(金航标); Supplier Footprint: SMD; Datasheet: https://atta.szlcsc.com/upload/public/pdf/source/20200911/C709357_AA8DCEB38BB20E3035A7ED7AE7667837.pdf; Supplier: LCSC; Connector Type: Type-C; Gender: 母; Number of Ports: 1; Number of Contacts: 16P; Mounting Style: 卧贴; Current Rating - Power (Max): 3A; Operating Temperature Range: -40℃~+85℃
C9 C13 C27 C28 C31 C33 C144 = CL10A106KP8NNNC: 容值:10uF;精度:±10%;额定电压:10V;材质(温度系数):X5R;; LCSC Part Name: 10uF ±10% 10V; Supplier Part: C19702; Manufacturer: SAMSUNG(三星); Supplier Footprint: 0603; JLCPCB Part Class: 基础库; Datasheet: https://atta.szlcsc.com/upload/public/pdf/source/20160218/1457707763339.pdf; Supplier: LCSC; Tolerance: ±10%; Voltage Rated: 10V; Temperature Coefficient: X5R
C88 = CL10A225KO8NNNC: 容值:2.2uF;精度:±10%;额定电压:16V;材质(温度系数):X5R;; LCSC Part Name: 2.2uF ±10% 16V; Supplier Part: C23630; Manufacturer: SAMSUNG(三星); Supplier Footprint: 0603; Datasheet: https://atta.szlcsc.com/upload/public/pdf/source/20160218/1457707763339.pdf; Supplier: LCSC; Tolerance: ±10%; Voltage Rated: 16V; Temperature Coefficient: X5R
C120-C123 = CC0603FRNPO9BN120: 容值:12pF;精度:±1%;额定电压:50V;材质(温度系数):NP0;; LCSC Part Name: 12pF ±1% 50V; Supplier Part: C519482; Manufacturer: YAGEO(国巨); Supplier Footprint: 0603; JLCPCB Part Class: 扩展库; Datasheet: https://atta.szlcsc.com/upload/public/pdf/source/20200423/C519482_89049CE53433C44DEC6365B4D6A7EBAA.pdf; Supplier: LCSC; Tolerance: ±1%; Voltage Rated: 50V; Temperature Coefficient: NP0
L8 = GZ1608D601TF: 标称阻抗@测试频率:600Ω@100MHz;误差:±25%;直流电阻(RDC):450mΩ;; LCSC Part Name: 单路 0603磁珠 阻抗600Ω@100MHz; Supplier Part: C1002; Manufacturer: Sunlord(顺络); Supplier Footprint: 0603; Datasheet: https://atta.szlcsc.com/upload/public/pdf/source/20231030/9B6A3E87682CEC1FF6638DFAA81D73FA.pdf; Supplier: LCSC; Impedance @ Frequency: 600Ω@100MHz; Tolerance: ±25%; DC Resistance: 450mΩ; Current Rating: 200mA; Circuits: 1
R14 = 0603WAF1005T5E: 电阻类型:厚膜电阻;阻值:10MΩ;精度:±1%;功率:100mW;最大工作电压:75V;温度系数:±100ppm/℃;; LCSC Part Name: 10MΩ ±1% 100mW 厚膜电阻; Supplier Part: C7250; Manufacturer: UNI-ROYAL(厚声); Supplier Footprint: 0603; JLCPCB Part Class: 基础库; Datasheet: https://atta.szlcsc.com/upload/public/pdf/source/20200306/C422600_1E6D84923E4A46A82E41ADD87F860B5C.pdf; Supplier: LCSC; Type: 厚膜电阻; Tolerance: ±1%; Power(Watts): 100mW; Overload Voltage (Max): 75V; Temperature Coefficient: ±100ppm/℃; Operating Temperature Range: -55℃~+155℃
R79 = 0603WAF0000T5E: 电阻类型:厚膜电阻;阻值:0Ω;精度:±1%;功率:100mW;最大工作电压:75V;; LCSC Part Name: 0Ω ±1% 100mW 厚膜电阻; Supplier Part: C21189; Manufacturer: UNI-ROYAL(厚声); Supplier Footprint: 0603; Datasheet: https://atta.szlcsc.com/upload/public/pdf/source/20200306/C422600_1E6D84923E4A46A82E41ADD87F860B5C.pdf; Supplier: LCSC; Type: 厚膜电阻; Tolerance: ±1%; Power(Watts): 100mW; Overload Voltage (Max): 75V; Operating Temperature Range: -55℃~+155℃
R123 = 0603WAF2400T5E: 电阻类型:厚膜电阻;阻值:240Ω;精度:±1%;功率:100mW;最大工作电压:75V;温度系数:±100ppm/℃;; LCSC Part Name: 240Ω ±1% 100mW 厚膜电阻; Supplier Part: C23350; Manufacturer: UNI-ROYAL(厚声); Supplier Footprint: 0603; JLCPCB Part Class: 扩展库; Datasheet: https://atta.szlcsc.com/upload/public/pdf/source/20200306/C422600_1E6D84923E4A46A82E41ADD87F860B5C.pdf; Supplier: LCSC; Type: 厚膜电阻; Tolerance: ±1%; Power(Watts): 100mW; Overload Voltage (Max): 75V; Temperature Coefficient: ±100ppm/℃; Operating Temperature Range: -55℃~+155℃
T1 = T113-S3: Supplier: 全志
X1 = XL2EL89COI-111YLC-24M: 频率： 24MHZ 负载： 12PF 频率公差： ±10PPM 工作温度： -40~85℃; LCSC Part Name: 24MHZ 12PF ±10PPM YSX321SL; Supplier Part: C5444545; Manufacturer: YXC(扬兴晶振); Supplier Footprint: SMD3225-4P; JLCPCB Part Class: Extended Part; Datasheet: https://atta.szlcsc.com/upload/public/pdf/source/20230822/747CCFB439F2D13D53454752F2993171.pdf; Supplier: LCSC
X2 = X321532768KGD2SI: 晶振类型:贴片晶振;频率:32.768kHz;常温频差:±20ppm;外接负载电容:12.5pF;频率稳定度(全温):-;; LCSC Part Name: 32.768kHz ±20ppm 12.5pF; Supplier Part: C620155; Manufacturer: YXC(扬兴晶振); Supplier Footprint: SMD3215-2P; JLCPCB Part Class: 扩展库; Datasheet: https://atta.szlcsc.com/upload/public/pdf/source/20240329/3A7650FD985DD0DE85694D3785AB4916.pdf; Supplier: LCSC; Crystal Type: 贴片晶振; Normal temperature Frequency Tolerance: ±20ppm; External load capacitor: 12.5pF; Operating Temperature: -40℃~+85℃
C119 C141 = CL10A105KB8NNNC: 容值:1uF;精度:±10%;额定电压:50V;材质(温度系数):X5R;; LCSC Part Name: 1uF ±10% 50V; Supplier Part: C15849; Manufacturer: SAMSUNG(三星); Supplier Footprint: 0603; JLCPCB Part Class: 基础库; Datasheet: https://atta.szlcsc.com/upload/public/pdf/source/20160218/1457707763339.pdf; Supplier: LCSC; Tolerance: ±10%; Voltage Rated: 50V; Temperature Coefficient: X5R
D22 = LMBR240FT1G: 正向压降(Vf):500mV;直流反向耐压(Vr):40V;平均整流电流(Io):2A;; LCSC Part Name: 电压:40V 电流:2A; Supplier Part: C383230; Manufacturer: LRC(乐山无线电); Supplier Footprint: SOD-123FL; Datasheet: https://atta.szlcsc.com/upload/public/pdf/source/20190402/C383230_DCB210DB16B98AEB58826699A4433AAF.pdf; Supplier: LCSC; Forward Voltage (Vf@If): 500mV; Reverse Voltage (Vr): 40V; Average Rectified Current (Io): 2A; Reverse Leakage Current (Ir): 100uA
FPC2 = FPC-05F-30PH20: 锁定特性:翻盖式;触点类型:下接;触点数量:30P;间距:0.5mm;安装类型:卧贴;工作温度范围:-25℃~+85℃;; LCSC Part Name: 间距:0.5mm P数:30P 翻盖式 下接; Supplier Part: C2856808; Manufacturer: XUNPU(讯普); Supplier Footprint: SMD,P=0.5mm,卧贴; JLCPCB Part Class: 扩展库; Datasheet: https://atta.szlcsc.com/upload/public/pdf/source/20210922/C2856808_4E6DDE2793CFD9EF09B771A8BD3338A4.pdf; Supplier: LCSC; Locking Feature: 翻盖式; Contact Type: 下接; Number of Contacts: 30P; Pitch: 0.5mm; Mounting Type: 卧贴; FFC, FCB Thickness: 0.3mm; Height Above Board: 2mm; Operating Temperature Range: -25℃~+85℃
FPC7 = AFC07-S06ECA-00: 锁定特性:抽屉式;触点类型:上接;触点数量:6P;间距:0.5mm;安装类型:卧贴;; LCSC Part Name: 间距:0.5mm P数:6P 抽屉式 上接; Supplier Part: C262579; Manufacturer: JS(钜硕电子); Supplier Footprint: SMD,P=0.5mm,卧贴; JLCPCB Part Class: 扩展库; Datasheet: https://atta.szlcsc.com/upload/public/pdf/source/20190726/C11082_A2E7B12387019CE4314BB5199EE0FDF4.pdf; Supplier: LCSC; Locking Feature: 抽屉式; Contact Type: 上接; Number of Contacts: 6P; Pitch: 0.5mm; Mounting Type: 卧贴; FFC, FCB Thickness: 0.3mm; Height Above Board: 2mm
L18 = WPN201610H100MT: 电感值:10uH;精度:±20%;额定电流:650mA;饱和电流(Isat):800mA;类型:-;; LCSC Part Name: 10uH ±20% 800mA; Supplier Part: C89132; Manufacturer: Sunlord(顺络); Supplier Footprint: 0806; JLCPCB Part Class: 扩展库; Datasheet: https://atta.szlcsc.com/upload/public/pdf/source/20231024/AA72387348CB63159A6CBE41DDE5ECDA.pdf; Supplier: LCSC; Tolerance: ±20%; Rated Current: 650mA; Saturation Current (Isat): 800mA; DC Resistance (DCR): 826mΩ
R121 = 0603WAF100JT5E: 电阻类型:厚膜电阻;阻值:10Ω;精度:±1%;功率:100mW;最大工作电压:75V;温度系数:±400ppm/℃;; LCSC Part Name: 10Ω ±1% 100mW 厚膜电阻; Supplier Part: C22859; Manufacturer: UNI-ROYAL(厚声); Supplier Footprint: 0603; Datasheet: https://atta.szlcsc.com/upload/public/pdf/source/20200306/C422600_1E6D84923E4A46A82E41ADD87F860B5C.pdf; Supplier: LCSC; Type: 厚膜电阻; Tolerance: ±1%; Power(Watts): 100mW; Overload Voltage (Max): 75V; Temperature Coefficient: ±400ppm/℃; Operating Temperature Range: -55℃~+155℃
R152-R163 = RT0603BRD0710KL: 电阻类型:薄膜电阻;阻值:10kΩ;精度:±0.1%;功率:100mW;最大工作电压:75V;温度系数:±25ppm/℃;; LCSC Part Name: 薄膜电阻 10kΩ ±0.1% 100mW; Supplier Part: C95204; Manufacturer: YAGEO(国巨); Supplier Footprint: 0603; JLCPCB Part Class: 扩展库; Datasheet: https://atta.szlcsc.com/upload/public/pdf/source/20170217/1487301593756.pdf; Supplier: LCSC; Type: 薄膜电阻; Tolerance: ±0.1%; Power(Watts): 100mW; Overload Voltage (Max): 75V; Temperature Coefficient: ±25ppm/℃; Operating Temperature Range: -55℃~+155℃
U52 = MT9201: Supplier Part: C182966; Manufacturer: 西安航天民芯; Supplier Footprint: SOT-23-6; Datasheet: https://atta.szlcsc.com/upload/public/pdf/source/20241129/868778C88584E0671C8F3044187EA392.pdf; Supplier: LCSC
U1 = W25N01GVZEIG: Supplier Part: C907680; Manufacturer: WINBOND(华邦); Supplier Footprint: WSON-8-EP(6.1x8); JLCPCB Part Class: 扩展库; Datasheet: https://atta.szlcsc.com/upload/public/pdf/source/20201021/C907645_0A29D2C383E097D6F46BF0FEEFAA9DEB.pdf; Supplier: LCSC
L10 = AN2051-245: 小体积，高增益，WIFI，蓝牙，zigBee 2.4G天线; Supplier Part: C99727; Manufacturer: rainsun(霖昱微); Supplier Footprint: 2x5.1mm; JLCPCB Part Class: 扩展库; Datasheet: https://atta.szlcsc.com/upload/public/pdf/source/20170329/1490752053541.pdf; Supplier: LCSC
R90 = 0603WAF330JT5E: 电阻类型:厚膜电阻;阻值:33Ω;精度:±1%;功率:100mW;最大工作电压:75V;温度系数:±100ppm/℃;; LCSC Part Name: 33Ω ±1% 100mW 厚膜电阻; Supplier Part: C23140; Manufacturer: UNI-ROYAL(厚声); Supplier Footprint: 0603; Datasheet: https://atta.szlcsc.com/upload/public/pdf/source/20200306/C422600_1E6D84923E4A46A82E41ADD87F860B5C.pdf; Supplier: LCSC; Type: 厚膜电阻; Tolerance: ±1%; Power(Watts): 100mW; Overload Voltage (Max): 75V; Temperature Coefficient: ±100ppm/℃; Operating Temperature Range: -55℃~+155℃
U5 = MX02
U11 = RTL8723DS模块: Supplier Part: C2920724; Supplier Footprint: SMD-44_12.0X12.0X0.90P; JLCPCB Part Class: 扩展库; Supplier: LCSC
L15-L17 L19 = CMI201209U2R2KT: 电感值:2.2uH;精度:±10%;额定电流:50mA;饱和电流(Isat):-;直流电阻(DCR):600mΩ;; LCSC Part Name: 2.2uH ±10% 600mΩ; Supplier Part: C1043; Manufacturer: FH(风华); Supplier Footprint: 0805; JLCPCB Part Class: 基础库; Datasheet: https://atta.szlcsc.com/upload/public/pdf/source/20230223/B5A9234764BD8EE53116685FAFCB16FA.pdf; Supplier: LCSC; Tolerance: ±10%; Rated Current: 50mA; DC Resistance (DCR): 600mΩ; Q @ Freq: 35@10MHz; Frequency - Self Resonant: 50MHz
R107 R110 = 0603WAF1503T5E: 电阻类型:厚膜电阻;阻值:150kΩ;精度:±1%;功率:100mW;; LCSC Part Name: 150kΩ ±1% 100mW; Supplier Part: C22807; Manufacturer: UNI-ROYAL(厚声); Supplier Footprint: 0603; JLCPCB Part Class: 基础库; Datasheet: https://atta.szlcsc.com/upload/public/pdf/source/20200306/C422600_1E6D84923E4A46A82E41ADD87F860B5C.pdf; Supplier: LCSC; Type: 厚膜电阻; Tolerance: ±1%; Power(Watts): 100mW; Temperature Coefficient: ±100ppm/℃; Overload Voltage (Max): 75V; Operating Temperature Range: -55℃~+155℃
R108 = 0603WAF6803T5E: 电阻类型:厚膜电阻;阻值:680kΩ;精度:±1%;功率:100mW;; LCSC Part Name: 680kΩ ±1% 100mW; Supplier Part: C25822; Manufacturer: UNI-ROYAL(厚声); Supplier Footprint: 0603; JLCPCB Part Class: 基础库; Datasheet: https://atta.szlcsc.com/upload/public/pdf/source/20200306/C422600_1E6D84923E4A46A82E41ADD87F860B5C.pdf; Supplier: LCSC; Type: 厚膜电阻; Tolerance: ±1%; Power(Watts): 100mW; Temperature Coefficient: ±100ppm/℃; Overload Voltage (Max): 75V; Operating Temperature Range: -55℃~+155℃
R109 = 0603WAF3003T5E: 电阻类型:厚膜电阻;阻值:300kΩ;精度:±1%;功率:100mW;; LCSC Part Name: 300kΩ ±1% 100mW; Supplier Part: C23024; Manufacturer: UNI-ROYAL(厚声); Supplier Footprint: 0603; JLCPCB Part Class: 基础库; Datasheet: https://atta.szlcsc.com/upload/public/pdf/source/20200306/C422600_1E6D84923E4A46A82E41ADD87F860B5C.pdf; Supplier: LCSC; Type: 厚膜电阻; Tolerance: ±1%; Power(Watts): 100mW; Temperature Coefficient: ±100ppm/℃; Overload Voltage (Max): 75V; Operating Temperature Range: -55℃~+155℃
R111 R150 = 0603WAF2003T5E: 电阻类型:厚膜电阻;阻值:200kΩ;精度:±1%;功率:100mW;最大工作电压:75V;温度系数:±100ppm/℃;; LCSC Part Name: 200kΩ ±1% 100mW 厚膜电阻; Supplier Part: C25811; Manufacturer: UNI-ROYAL(厚声); Supplier Footprint: 0603; JLCPCB Part Class: 基础库; Datasheet: https://atta.szlcsc.com/upload/public/pdf/source/20200306/C422600_1E6D84923E4A46A82E41ADD87F860B5C.pdf; Supplier: LCSC; Type: 厚膜电阻; Tolerance: ±1%; Power(Watts): 100mW; Overload Voltage (Max): 75V; Temperature Coefficient: ±100ppm/℃; Operating Temperature Range: -55℃~+155℃
R112 = 0603WAF3003T5E: 电阻类型:厚膜电阻;阻值:300kΩ;精度:±1%;功率:100mW;最大工作电压:75V;温度系数:±100ppm/℃;; LCSC Part Name: 300kΩ ±1% 100mW 厚膜电阻; Supplier Part: C23024; Manufacturer: UNI-ROYAL(厚声); Supplier Footprint: 0603; JLCPCB Part Class: 基础库; Datasheet: https://atta.szlcsc.com/upload/public/pdf/source/20200306/C422600_1E6D84923E4A46A82E41ADD87F860B5C.pdf; Supplier: LCSC; Type: 厚膜电阻; Tolerance: ±1%; Power(Watts): 100mW; Overload Voltage (Max): 75V; Temperature Coefficient: ±100ppm/℃; Operating Temperature Range: -55℃~+155℃
R151 = ARG03BTC1003: 电阻类型:薄膜电阻;阻值:100kΩ;精度:±0.1%;功率:100mW;最大工作电压:75V;温度系数:±25ppm/℃;; LCSC Part Name: 薄膜电阻 100kΩ ±0.1% 100mW; Supplier Part: C335088; Manufacturer: Viking(光颉); Supplier Footprint: 0603; JLCPCB Part Class: 扩展库; Datasheet: https://atta.szlcsc.com/upload/public/pdf/source/20200117/C485675_99063924B4564AF910B7BE66DA8EFA49.pdf; Supplier: LCSC; Type: 薄膜电阻; Tolerance: ±0.1%; Power(Watts): 100mW; Overload Voltage (Max): 75V; Temperature Coefficient: ±25ppm/℃; Operating Temperature Range: -55℃~+155℃
U27-U29 U53 = SY8088AAC: 功能类型:降压型;同步整流:-;输出通道数:-;拓扑结构:-;输入电压:-;输出电流(最大值):-;开关频率:-;; LCSC Part Name: 降压型; Supplier Part: C79313; Manufacturer: silergy(矽力杰); Supplier Footprint: SOT-23-5; JLCPCB Part Class: 扩展库; Datasheet: https://atta.szlcsc.com/upload/public/pdf/source/20170329/1490752163260.pdf; Supplier: LCSC; Function: 降压型

## Nets
0V9: C9.2 C12.2 C27.2 C28.2 C29.2 C30.2 C112.2 L17.2 R110.2 T1.46(VDD-SYS0) T1.51(VDD-SYS1) T1.81(VDD-SYS2) T1.116(VDD-CORE0) T1.117(VDD-CORE1)
1V5: C13.2 C14.2 C110.2 L16.2 R109.2 T1.48(VCC-DRAM0) T1.49(VCC-DRAM1)
1V8: C21.2 C31.2 C33.2 C34.2 C36.2 C37.2 C38.2 C88.2 C147.2 L8.2 L19.2 R148.2 R150.2 T1.20(VCC-PLL) T1.26(VCC-RTC) T1.50(VDD18-DRAM) T1.65(VCC-LVDS) T1.97(HPVCC)
3V3: C1.1 C15.2 C16.2 C17.2 C19.2 C63.2 C64.2 C65.2 C108.2 C144.2 C145.2 FPC2.26 FPC2.27 FPC7.6 L15.2 R13.2 R52.2 R91.2 R93.2 R108.2 R122.2 R124.1 R126.2 R145.1 R152.2 R153.2 R154.2 R155.2 R156.2 R157.2 R158.2 R159.2 R160.2 R161.2 R162.2 R163.2 T1.34(VCC-PE) T1.66(VCC-PD) T1.83(VCC-IO) T1.128(VCC-PG) U1.8(VCC) U5.10(3V3) U11.9(VBAT_IN) U11.22(VDDIO)
5V: C107.2 C109.2 C111.2 C115.2 C116.2 C139.2 C141.2 C146.2 D19.1(C) L18.1 R115.1 U27.1(EN) U27.4(IN) U28.1(EN) U28.4(IN) U29.1(EN) U29.4(IN) U47.6(VDD) U52.6(VIN) U53.1(EN) U53.4(IN) USB9.A4(VBUS) USB9.A9(VBUS) USB9.B4(VBUS) USB9.B9(VBUS)
AGND: C31.1 C82.2 C83.2 C88.1 C143.2 R79.2 R146.1 T1.91(AGND)
GND: C1.2 C9.1 C12.1 C13.1 C14.1 C15.1 C16.1 C17.1 C19.1 C21.1 C27.1 C28.1 C29.1 C30.1 C33.1 C34.1 C36.1 C37.1 C38.1 C41.1 C63.1 C64.1 C65.1 C91.1 C107.1 C108.1 C109.1 C110.1 C111.1 C112.1 C115.1 C116.1 C119.1 C120.2 C121.1 C122.1 C123.1 C124.1 C138.1 C139.1 C141.1 C144.1 C145.1 C146.1 C147.1 CN2.3 CN2.4 FPC2.7 FPC2.10 FPC2.13 FPC2.16 FPC2.19 FPC2.22 FPC2.31 FPC2.32 FPC7.1 FPC7.7 FPC7.8 LED3.1(-) R79.1 R107.1 R111.1 R112.1 R113.1 R114.2 R120.1 R121.1 R123.1 R135.1 R138.1 R141.1 R142.2 R151.1 SW1.2 SW2.2 SW5.2 T1.99(HPOUTL) T1.129(EPAD) U1.4(VSS) U1.9(EP) U5.11(GND) U5.16(P06) U11.1(AGND) U11.3(AGND) U11.20(AGND) U11.31(AGND) U11.33(AGND) U11.36(AGND) U21.2 U24.3 U24.4 U24.5 U27.2(GND) U28.2(GND) U29.2(GND) U33.1 U34.2 U35.1 U36.1 U37.1 U38.2 U41.1 U42.1 U47.7(GND) U49.1 U50.1 U52.2(GND) U53.2(GND) USB9.1(EP) USB9.2(EP) USB9.3(EP) USB9.4(EP) USB9.A1(GND) USB9.A12(GND) USB9.B1(GND) USB9.B12(GND) USB10.1(EP) USB10.2(EP) USB10.3(EP) USB10.4(EP) USB10.A1(GND) USB10.A12(GND) USB10.B1(GND) USB10.B12(GND) X1.2(GND) X1.4(GND)
VIN5V: D19.2(A) USB10.A4(VBUS) USB10.A9(VBUS) USB10.B4(VBUS) USB10.B9(VBUS)
BTN1: C124.2 R126.1 SW5.1 T1.67(PD10) U42.2
DXIN: C122.2 T1.23(DXIN) X1.1
DXOUT: C123.2 T1.22(DXOUT) X1.3
HPOUT_FB: C91.2 T1.100(HPOUTFB)
HPOUTR: C135.1 C142.1 T1.98(HPOUTR)
LCD_CLK_N: FPC2.14 T1.60(PD5)
LCD_CLK_P: FPC2.15 T1.59(PD4)
LCD_PWM: R120.2 T1.52(PD22) U52.4(EN)
LED1: LED4.1(-) T1.68(PD11)
LEDA: C119.2 D22.1(C) FPC2.30 U52.5(OV)
LEDK: FPC2.28 FPC2.29 R121.2 U52.3(FB)
MIC_IN_3N: C86.2 T1.88(MICIN3N)
MIC_IN_3P: C85.2 T1.87(MICIN3P)
MIPI_0_N: FPC2.20 T1.56(PD1)
MIPI_0_P: FPC2.21 T1.55(PD0)
MIPI_1_N: FPC2.17 T1.58(PD3)
MIPI_1_P: FPC2.18 T1.57(PD2)
MIPI_2_N: FPC2.11 T1.62(PD7)
MIPI_2_P: FPC2.12 T1.61(PD6)
MIPI_3_N: FPC2.8 T1.64(PD9)
MIPI_3_P: FPC2.9 T1.63(PD8)
MIPI_LCD_RST: FPC2.25 T1.54(PD20)
MIPI_LCD_TE: FPC2.24 T1.53(PD21)
PA_SHDN: R138.2 T1.86(PB2) U47.1(nSHUTDOWN)
RESET: C41.2 R13.1 SW2.1 T1.27(RESET) U41.2
SPI0_CLK: T1.19(PC2) U1.6(CLK)
SPI0_CS: R122.1 T1.18(PC3) U1.1(CS#)
SPI0_HOLD: R93.1 T1.14(PC7) U1.7(HOLD#(DQ3))
SPI0_MISO: T1.16(PC5) U1.2(DO(DQ1))
SPI0_MOSI: SW1.1 T1.17(PC4) U1.5(DI(DQ0)) U21.1
SPI0_WP: R145.2 T1.15(PC6) U1.3(WP#(DQ2))
TP_INT: FPC7.2 R163.1 T1.42(PE5)
TP_RST: FPC7.5 R160.1 T1.43(PE4)
TP_SCL: FPC7.4 R161.1 T1.44(PE0)
TP_SDA: FPC7.3 R162.1 T1.45(PE1)
UART0_RX: T1.33(PE3) U5.9(P02/TX)
UART0_TX: T1.35(PE2) U5.8(P03/RX)
UART1_CTS: T1.4(PG9) U11.41(UART_RTS)
UART1_RTS: T1.3(PG8) U11.44(UART_CTS)
UART1_RX: T1.2(PG7) U11.42(UART_OUT)
UART1_TX: T1.1(PG6) U11.43(UART_IN)
UART3_RX: T1.79(PB7) U24.1 U38.1
UART3_TX: T1.80(PB6) U24.2 U37.2
USB0_DM: T1.114(USB0-DM) U34.1 USB10.A7(DN1) USB10.B7(DN2)
USB0_DP: T1.115(USB0-DP) U33.2 USB10.A6(DP1) USB10.B6(DP2)
USB1_DM: T1.113(USB1-DM) U35.2 USB9.A7(DN1) USB9.B7(DN2)
USB1_DP: T1.112(USB1-DP) U36.2 USB9.A6(DP1) USB9.B6(DP2)
WL_SDIO_CLK: R90.1 T1.120(PG0)
WL_SDIO_CMD: R159.1 T1.118(PG1) U11.16(SD_CMD)
WL_SDIO_D0: R157.1 T1.119(PG2) U11.18(SD_D0)
WL_SDIO_D1: R156.1 T1.121(PG3) U11.19(SD_D1)
WL_SDIO_D2: R153.1 T1.123(PG4) U11.14(SD_D2)
WL_SDIO_D3: R152.1 T1.122(PG5) U11.15(SD_D3)
X32KIN: C121.2 R14.1 T1.25(X32KIN) X2.2
X32KOUT: C120.1 R14.2 T1.24(X32KOUT) X2.1
$1N8485: R123.2 T1.47(DZQ)
$1N8660: C82.1 T1.92(VRA1)
$1N8664: C83.1 T1.90(VRA2)
$1N9592: L8.1 T1.89(AVCC)
$2N956: L10.1(ANT) U11.2(ANT)
$2N973: R52.1 U11.34(BT_DIS#)
$2N981: R90.2 R158.1 U11.17(SD_CLK)
$2N996: R91.1 U11.24(SUSCLK_IN)
$2N1733: R155.1 U11.12(WL_DIS#)
$2N1928: R154.1 U11.13(WL_DEV_WAKE_HOST)
$3N3400: R107.2 R108.1 U27.5(FB)
$3N3401: L15.1 U27.3(LX)
$3N3408: R109.1 R111.2 U28.5(FB)
$3N3409: L16.1 U28.3(LX)
$3N3416: R110.1 R112.2 U29.5(FB)
$3N3417: L17.1 U29.3(LX)
$3N10156: R150.1 R151.2 U53.5(FB)
$3N10157: L19.1 U53.3(LX)
$4N1093: R113.2 USB9.A5(CC1)
$4N1094: R114.1 USB9.B5(CC2)
$4N1104: LED3.2(+) R115.2
$4N2876: LED4.2(+) R124.2
$4N6998: R141.2 USB10.A5(CC1)
$4N6999: R142.1 USB10.B5(CC2)
$5N432: C143.1 R147.2 R148.1
$5N435: C86.1 C87.1 MIC2.2 R146.2
$5N436: C85.1 C87.2 MIC2.1 R147.1
$5N4459: C135.2 R135.2
$5N4736: C142.2 R136.1
$5N4749: R136.2 R149.1 U47.4(-IN)
$5N4808: C138.2 U47.2(BYPASS) U47.3(+IN)
$5N4897: CN2.1 U47.8(Vo2) U50.2
$5N4898: CN2.2 R149.2 U47.5(Vo1) U49.2
$7N1193: D22.2(A) L18.2 U52.1(SW)

Not connected (* = marked no-connect by the designer): FPC2 1* 2* 3* 4* 5* 6* 23*; L10 2*; T1 5(PG10)* 6(PG11)* 7(PF0)* 8(PF1)* 9(PF2)* 10(PF3)* 11(PF4)* 12(PF5)* 13(PF6)* 21(REFCLK-OUT)* 28(LDOA-OUT)* 29(LDO-IN)* 30(LDOB-OUT)* 31(PE13)* 32(PE12)* 36(PE11)* 37(PE10)* 38(PE9)* 39(PE8)* 40(PE7)* 41(PE6)* 69(PD13)* 70(PD12)* 71(PD14)* 72(PD15)* 73(PD16)* 74(PD17)* 75(PD18)* 76(PD19)* 77(VCC-TVOUT)* 78(TVOUT0)* 82(PB5)* 84(PB4)* 85(PB3)* 93(FMINR)* 94(FMINL)* 95(LINEINR)* 96(LINEINL)* 101(GPADC0)* 102(TP-X1)* 103(TP-X2)* 104(TP-Y1)* 105(TP-Y2)* 106(NC0)* 107(VCC-TVIN)* 108(TVIN0)* 109(TVIN1)* 110(TVIN-VRP)* 111(TVIN-VRN)* 124(PG12)* 125(PG13)* 126(PG14)* 127(PG15)*; U5 1(ANT)* 2(GND)* 3(NC)* 4(NC)* 5(P08)* 6(P09)* 7(P10)* 12(P05)* 13(P04)* 14(RST)* 15(SEL0)* 17(NC)* 18(NC)*; U11 4(NC)* 5(NC)* 6(BT_HOST_WAKE_DEV)* 7(BT_DEV_WAKE_HOST)* 8(NC)* 10(NC)* 11(NC)* 21(NC)* 23(NC)* 25(PCM_OUT)* 26(PCM_CLK)* 27(PCM_IN)* 28(PCM_SYNC)* 29(NC)* 30(MAIN_XTAL_IN)* 32(NC)* 35(VBAT_EN)* 37(NC)* 38(NC)* 39(NC)* 40(NC)*; USB9 A8(SUB1)* B8(SUB2)*; USB10 A8(SUB1)* B8(SUB2)*

## Notes on the sheets
sheet 1
- T113S3
- 晶振电路
- 复位电路
sheet 2
- 蓝牙Mesh模块
- P06
  0-发送或接收数据
  1-不再接收数据，低功耗模式
- WiFi模块
- RTL8723DS 需要
  RTL8189 需要
  RTL8723BS 不需要
sheet 3
- 5V转3.3V
- 电源组
- Vout=0.6*(1+Ra/Rb)
- T113-S3的VCC-PC/PF在芯片内部连接到VCC-IO
- 5V转1.5V
- 5V转0.9V
- 使用T113S3时VCC-DRAM应该使用1.5V
- 5V转1.8V
sheet 4
- USB1-调试
- 指示灯&电源防倒灌
- USB0-供电&扩展
- UART3
- LED模块
- 按键模块
sheet 5
- 麦克风MIC模块
- 扬声器功放模块
- FYI:这里不使用芯片手册推荐的68k，使用20k，
  降低输出功率，减少芯片发热。
sheet 6
- FLASH模块
sheet 7
- LCD接口
- LCD背光
- MIPI_LCD_TE：输出引脚，表示LCD状态
  MIPI_LCD_RST: 复位引脚，拉低复位
- TP
